# EasyEDA Pro project projet666.eprj, schematic Schematic1

## Sheets
1 Pont + connecteurs: Board Name: Board1; Create Date: 2025-08-06; Page Name: Pont + connecteurs; Project Name: projet666; Schematic Name: Schematic1; Update Date: 2026-02-17; Company: EasyEDA.com; Page Size: A4; Version: V1.0
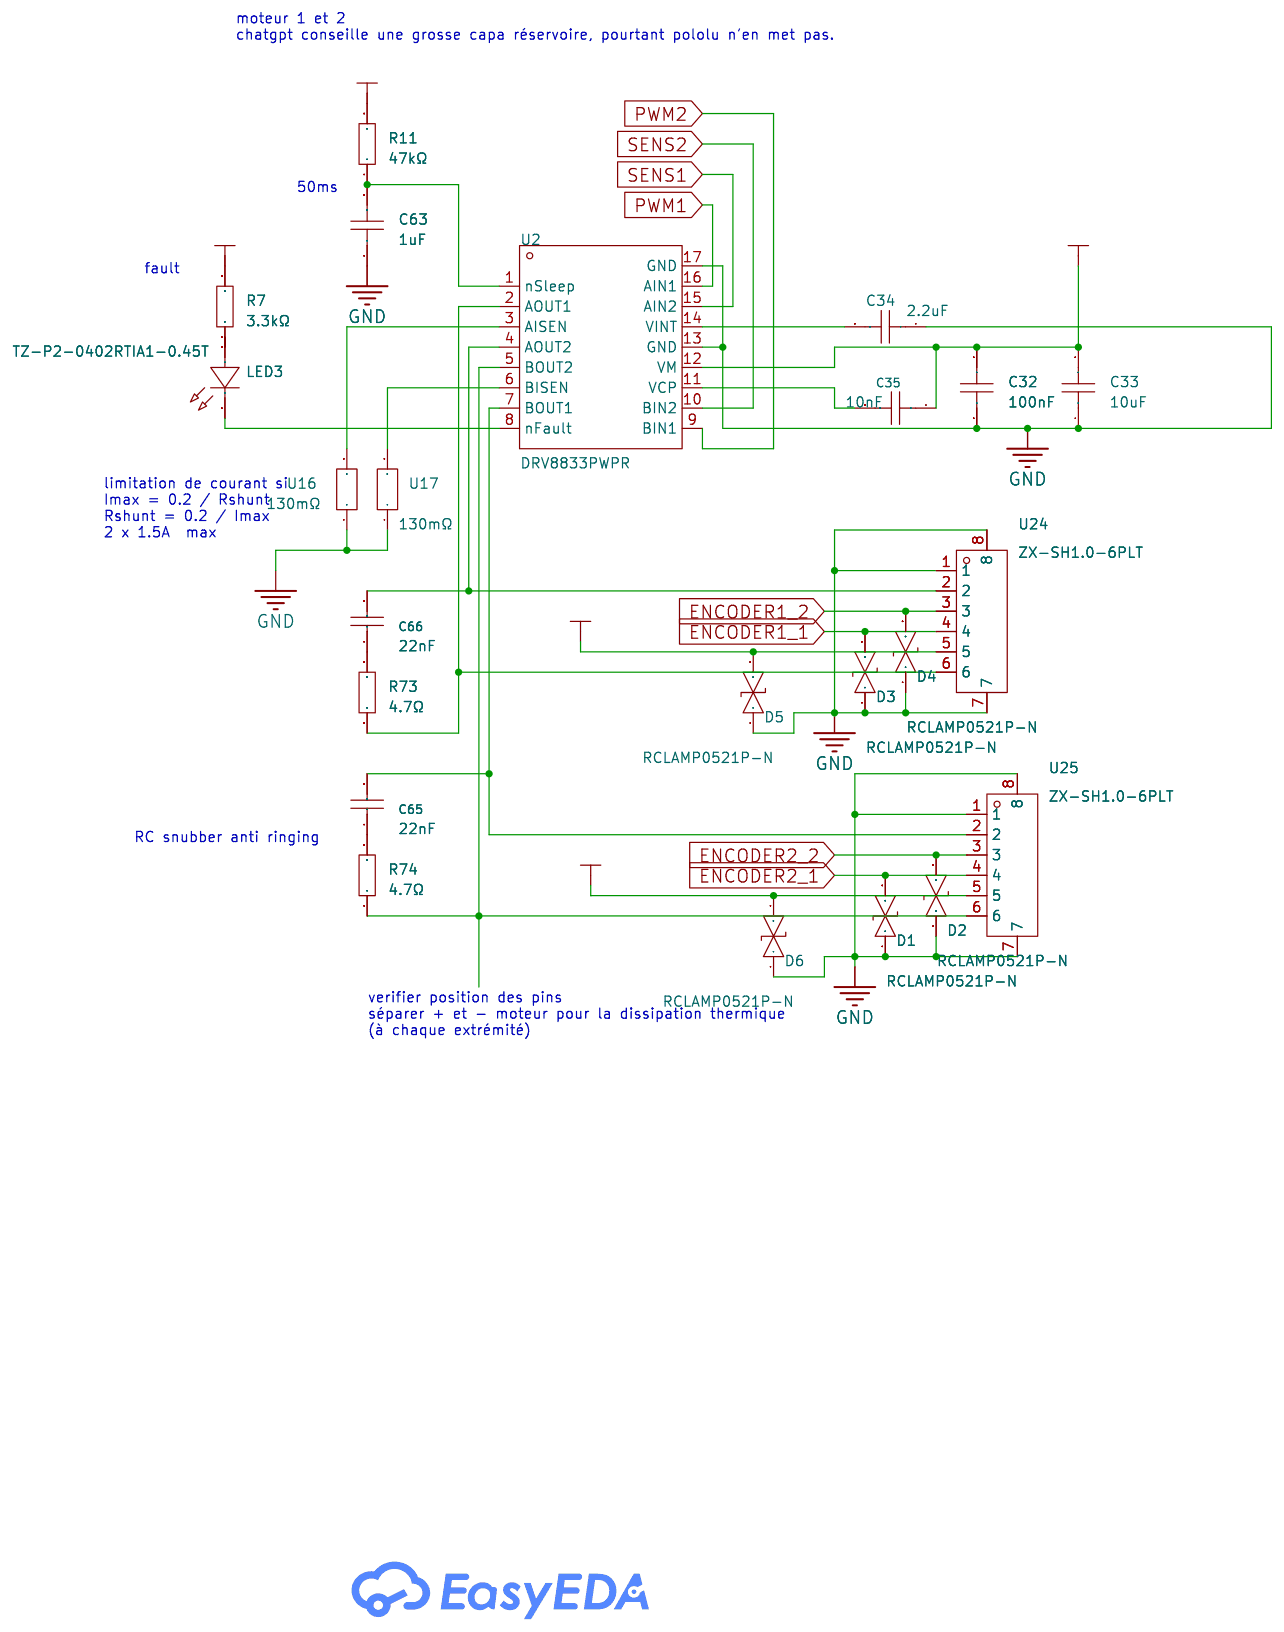
[diagram p0: Pont + connecteurs]
2 stm32: Page Name: stm32; Update Date: 2026-01-31
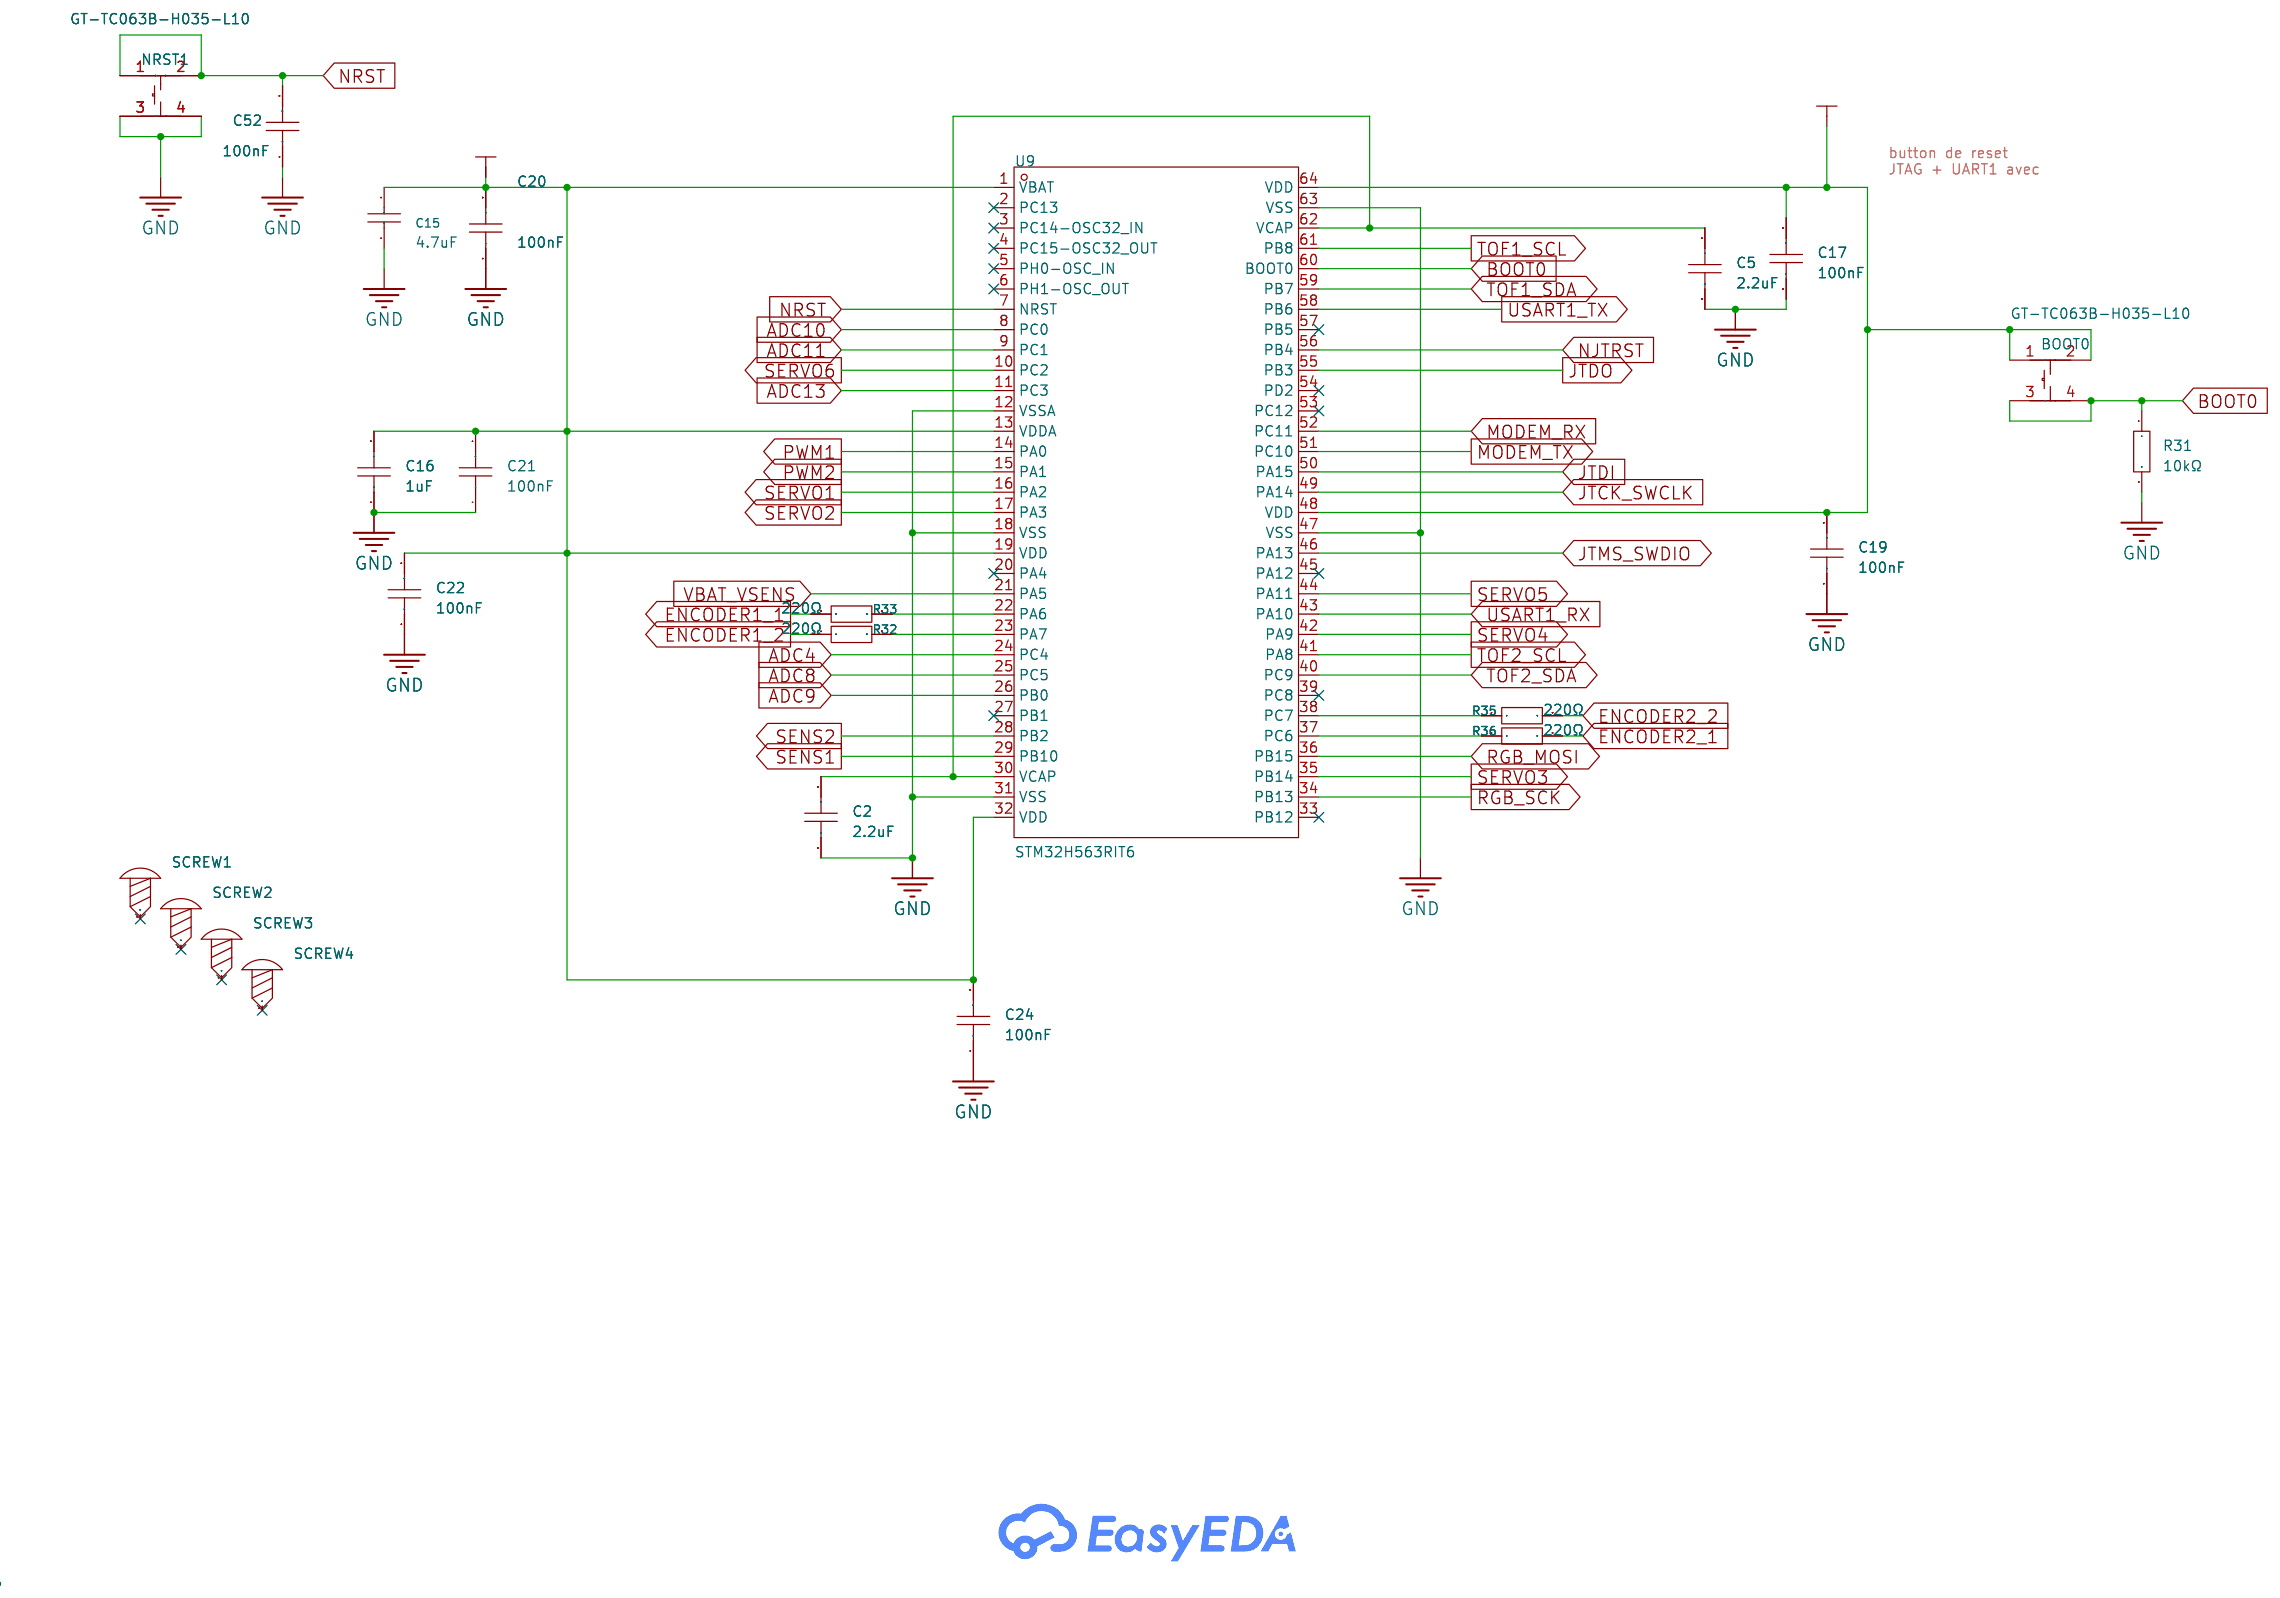
[diagram p1: stm32]
3 alim: Page Name: alim
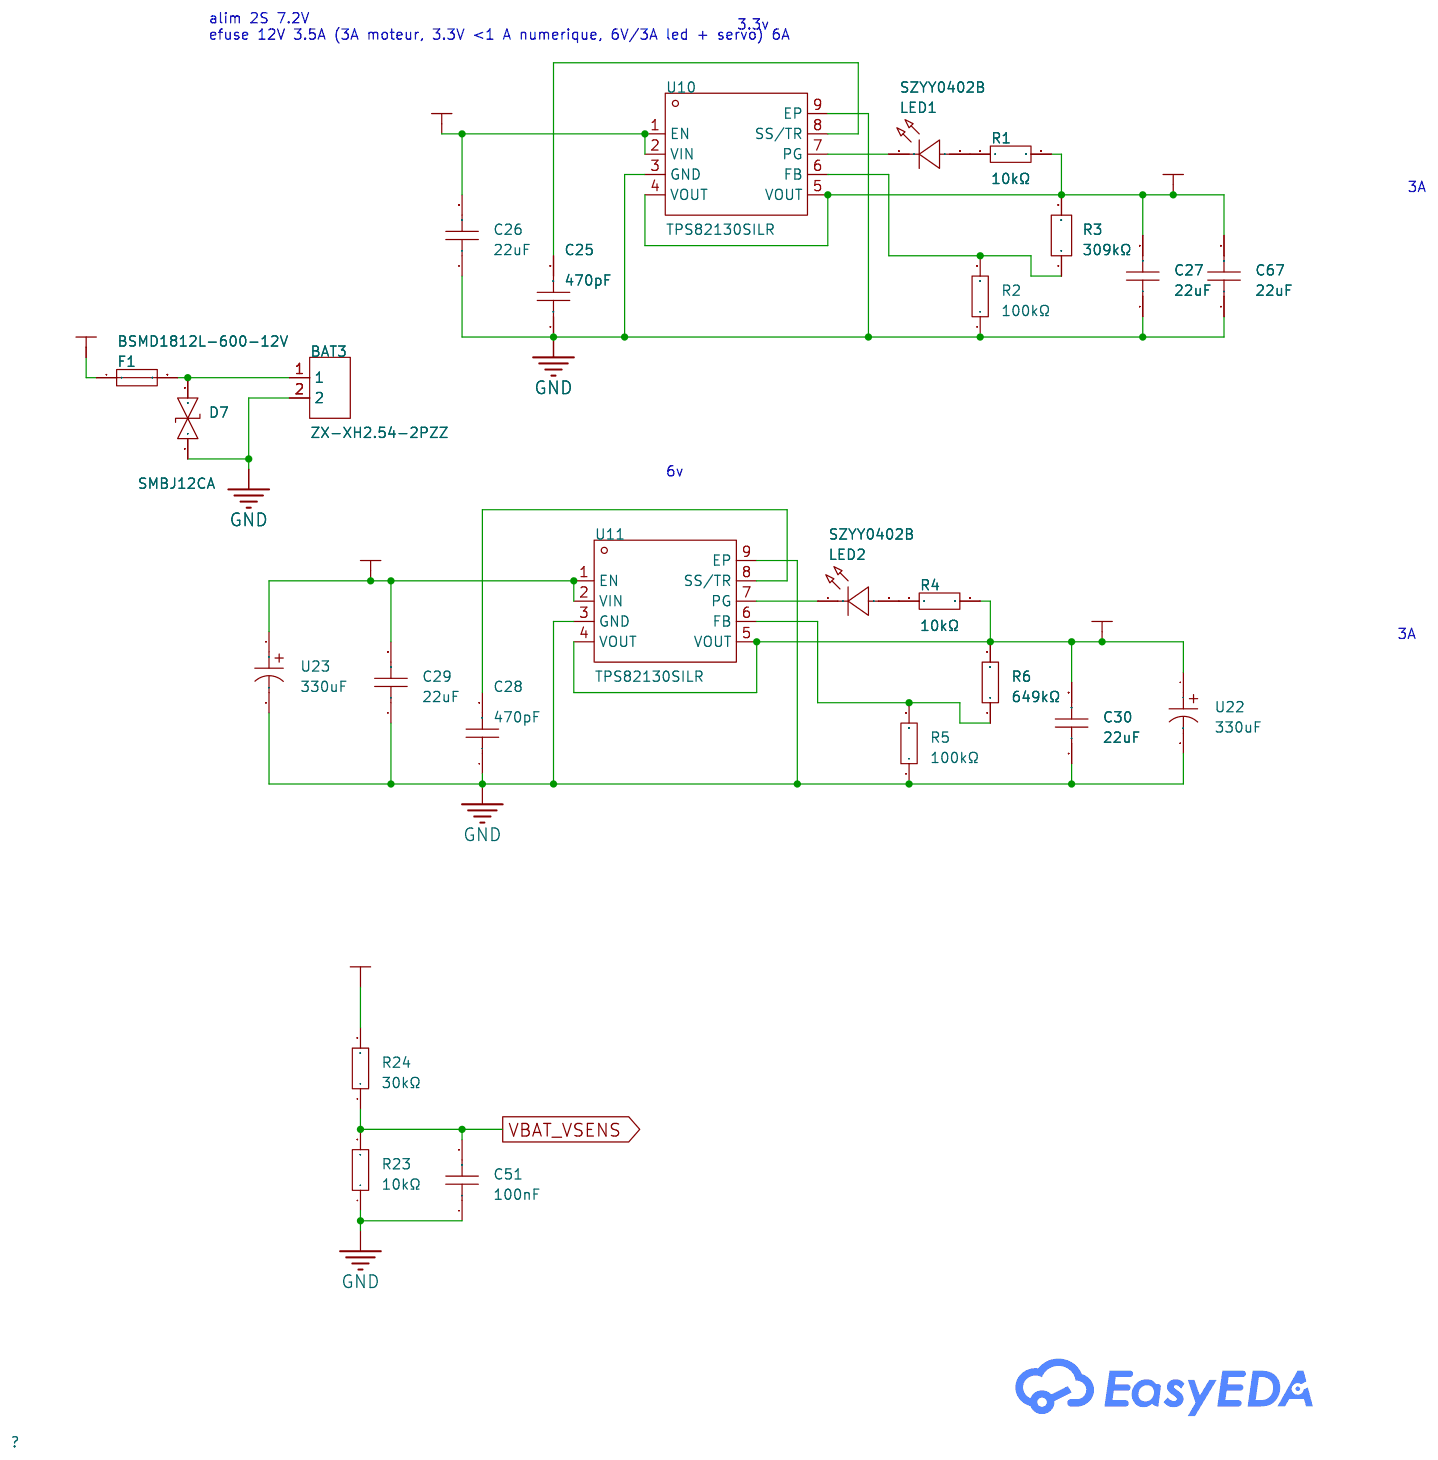
[diagram p2: alim]
4 tof: Page Name: tof; Update Date: 2025-09-26
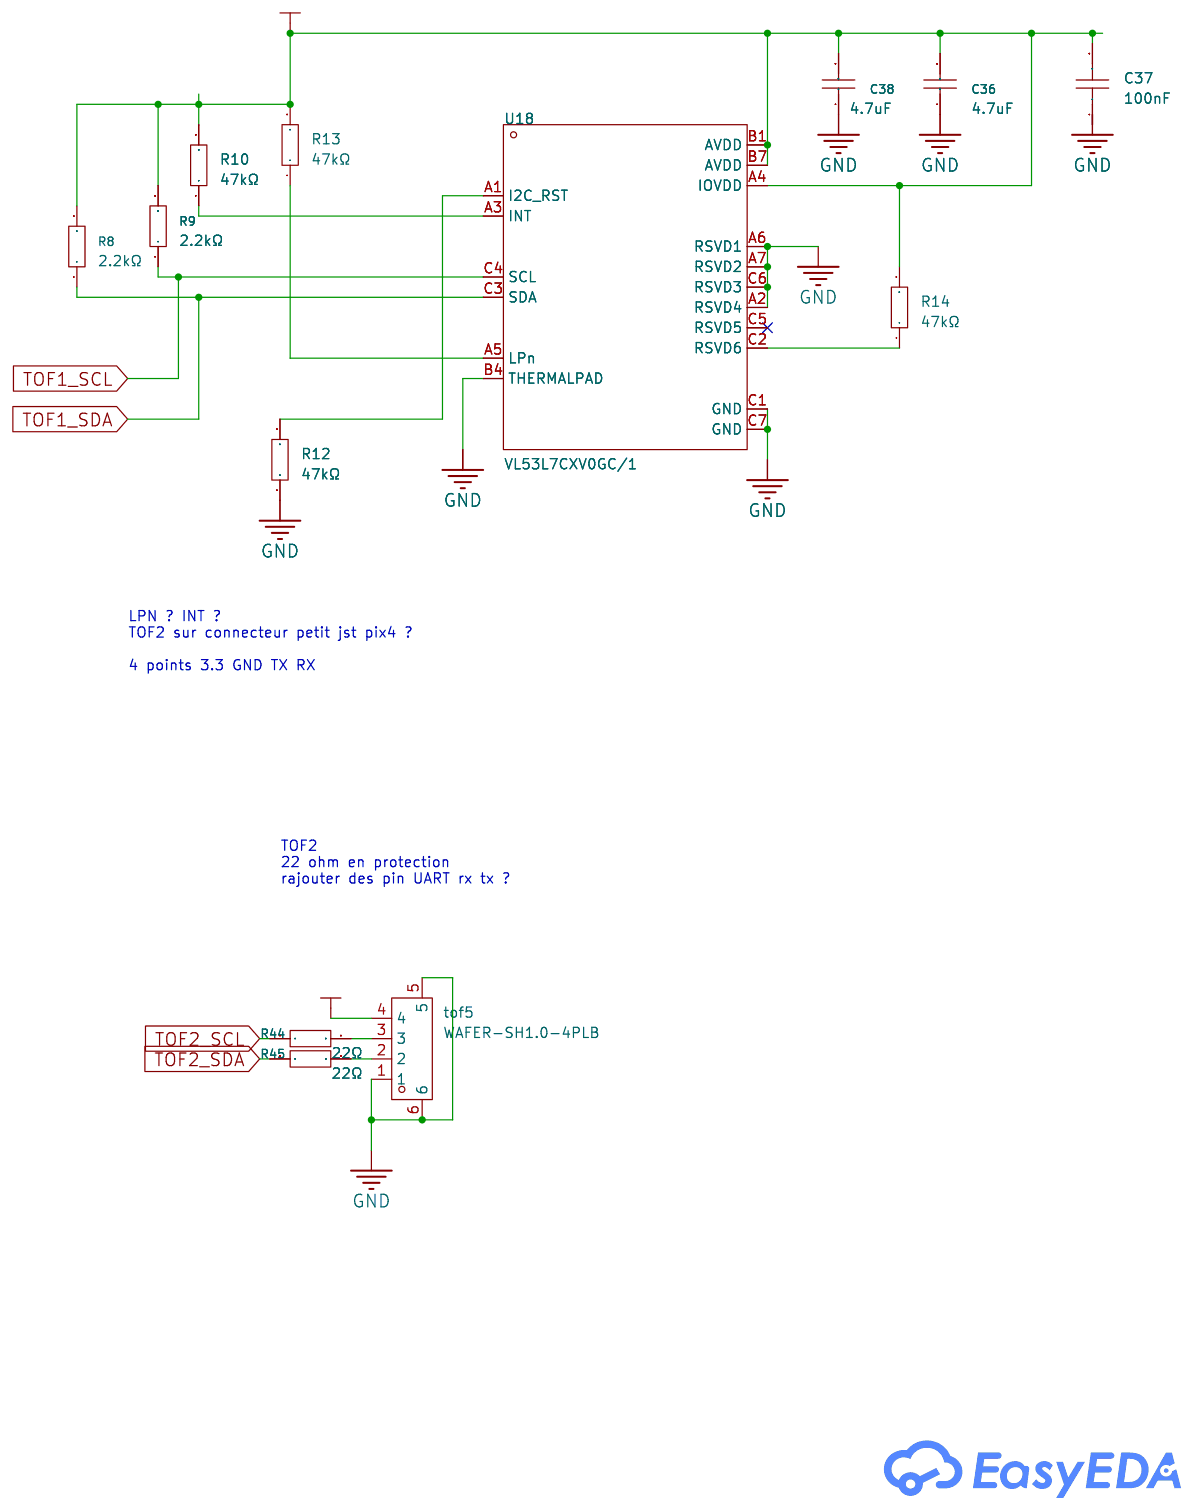
[diagram p3: tof]
5 leds: Create Date: 2025-08-11; Page Name: leds; Update Date: 2026-02-08
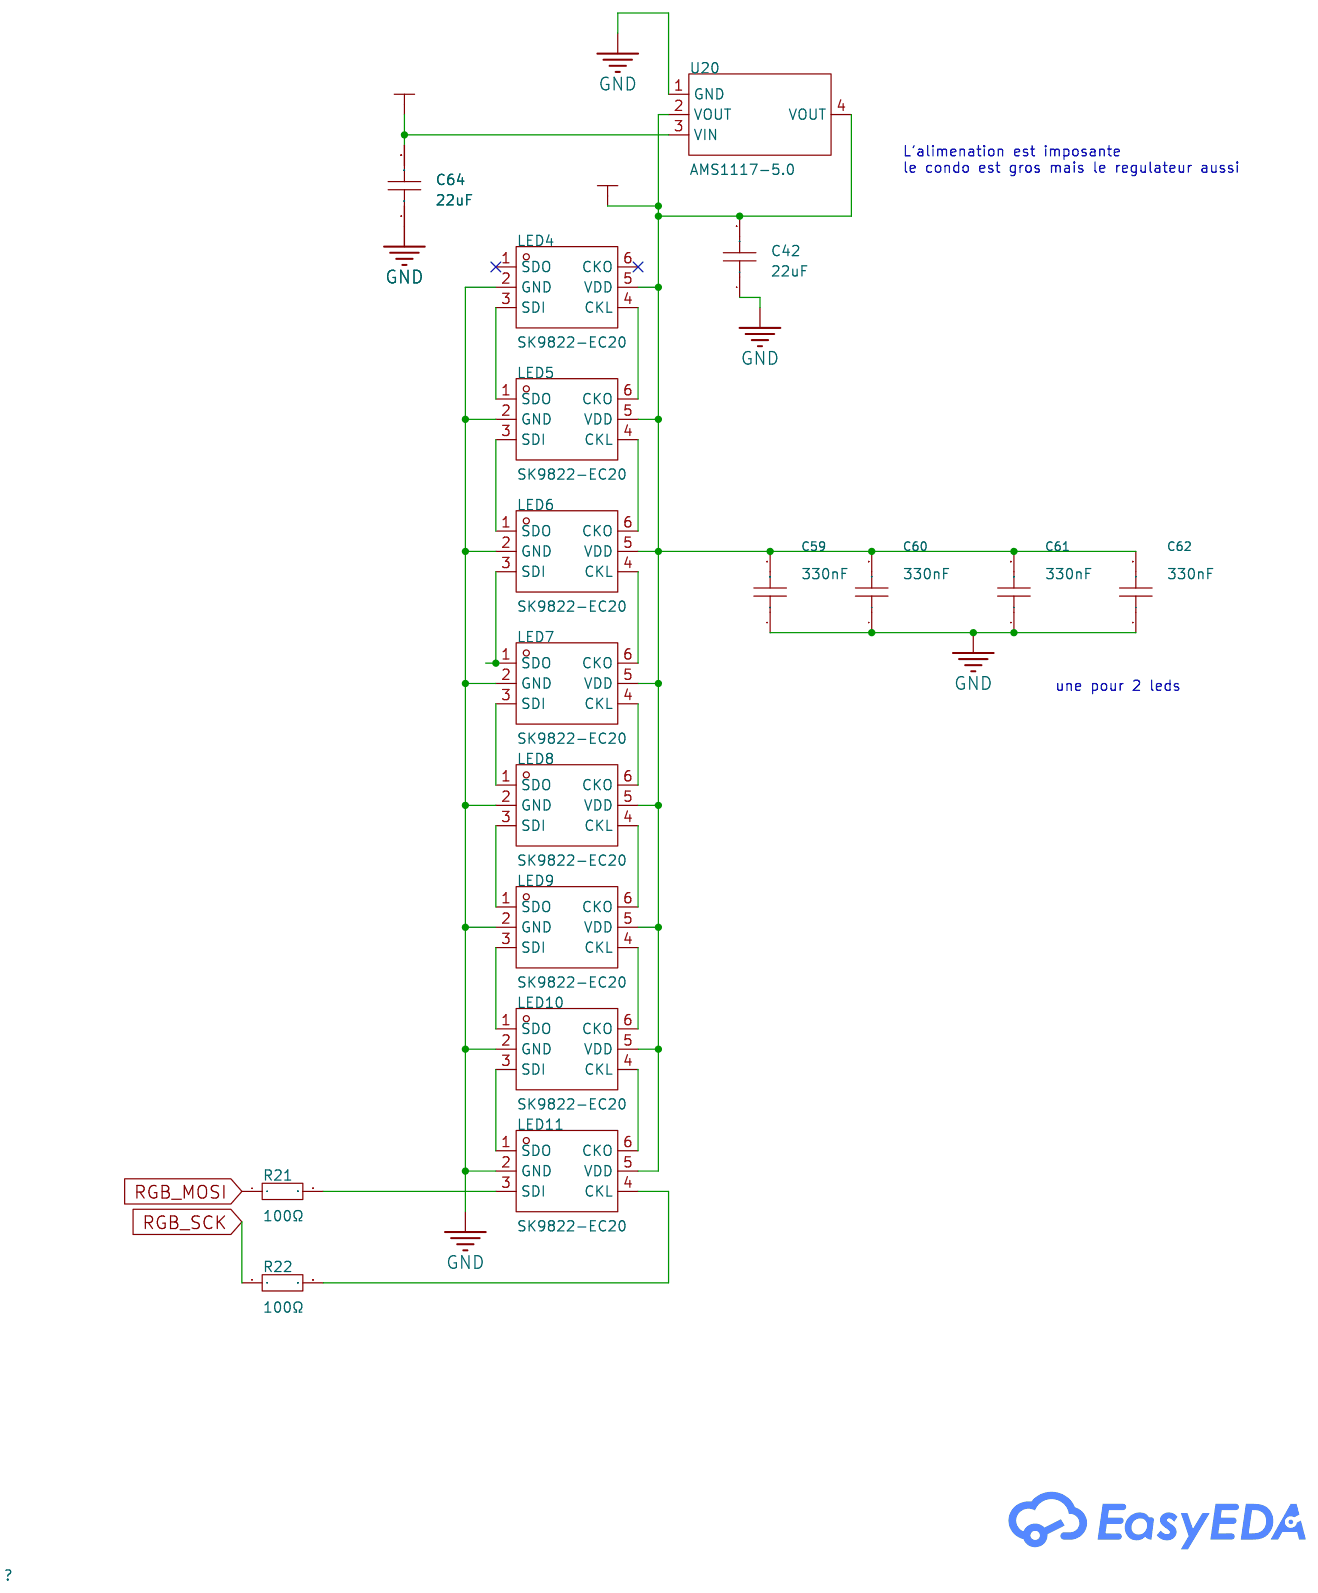
[diagram p4: leds]
6 servo: Create Date: 2025-08-26; Page Name: servo
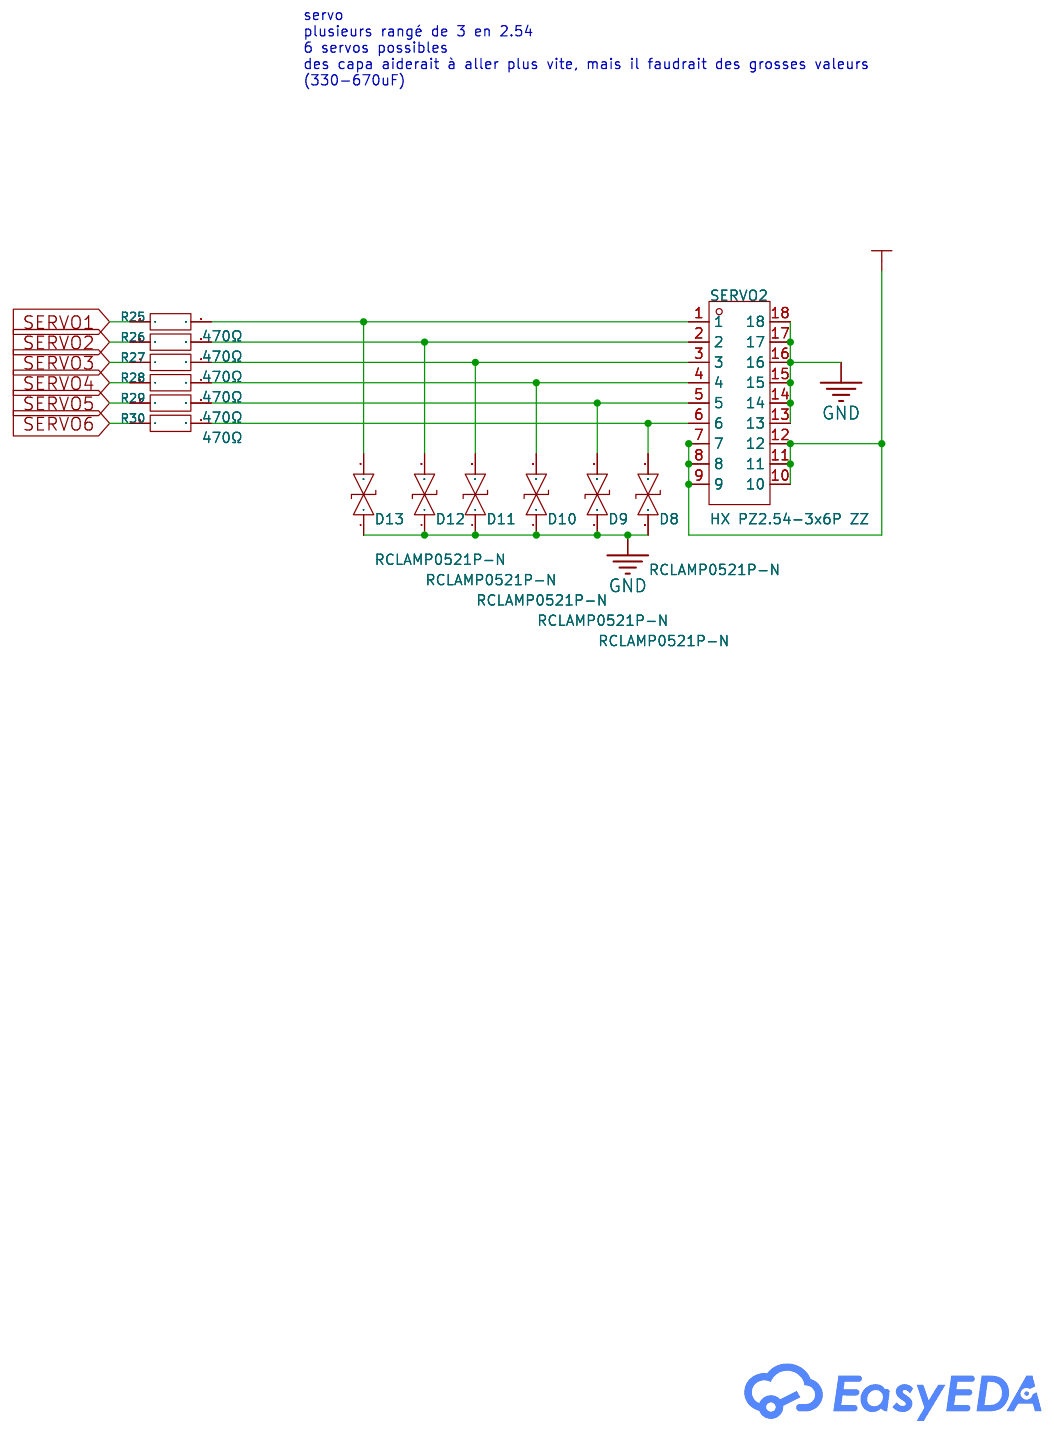
[diagram p5: servo]
7 esp32: Create Date: 2025-08-30; Page Name: esp32; Update Date: 2026-02-01
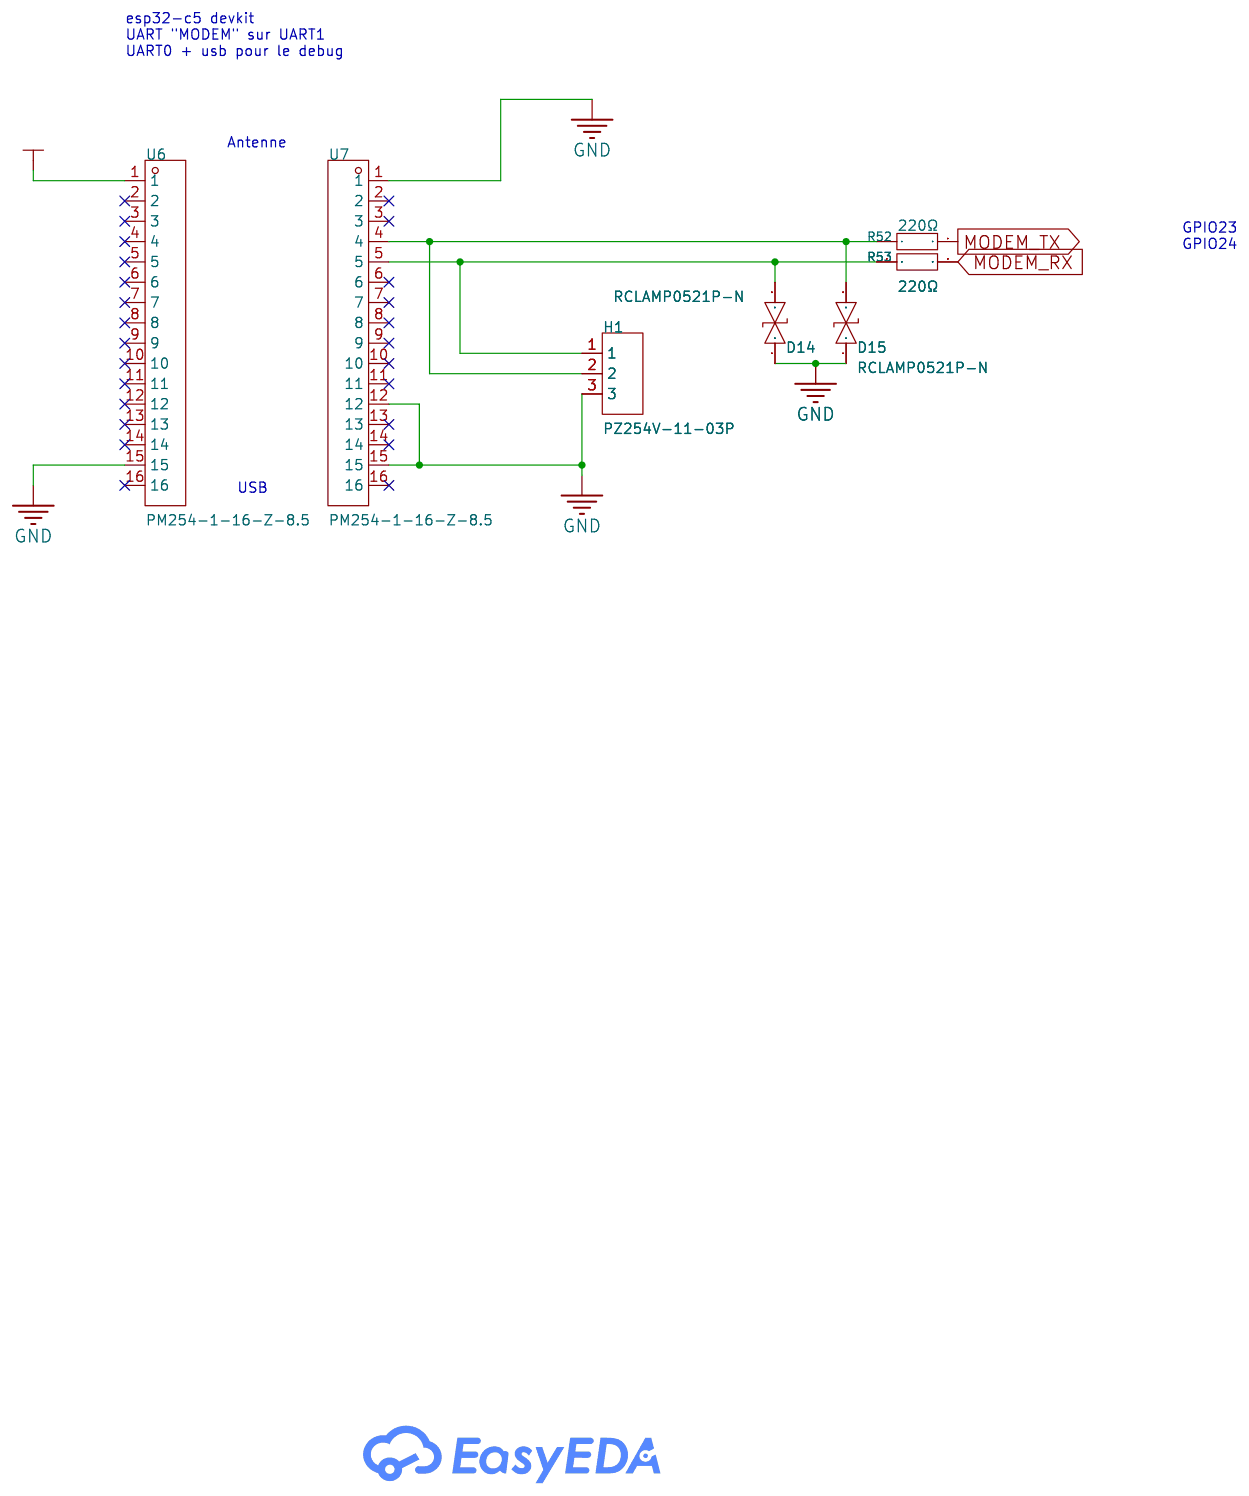
[diagram p6: esp32]
8 jtag: Create Date: 2025-08-30; Page Name: jtag
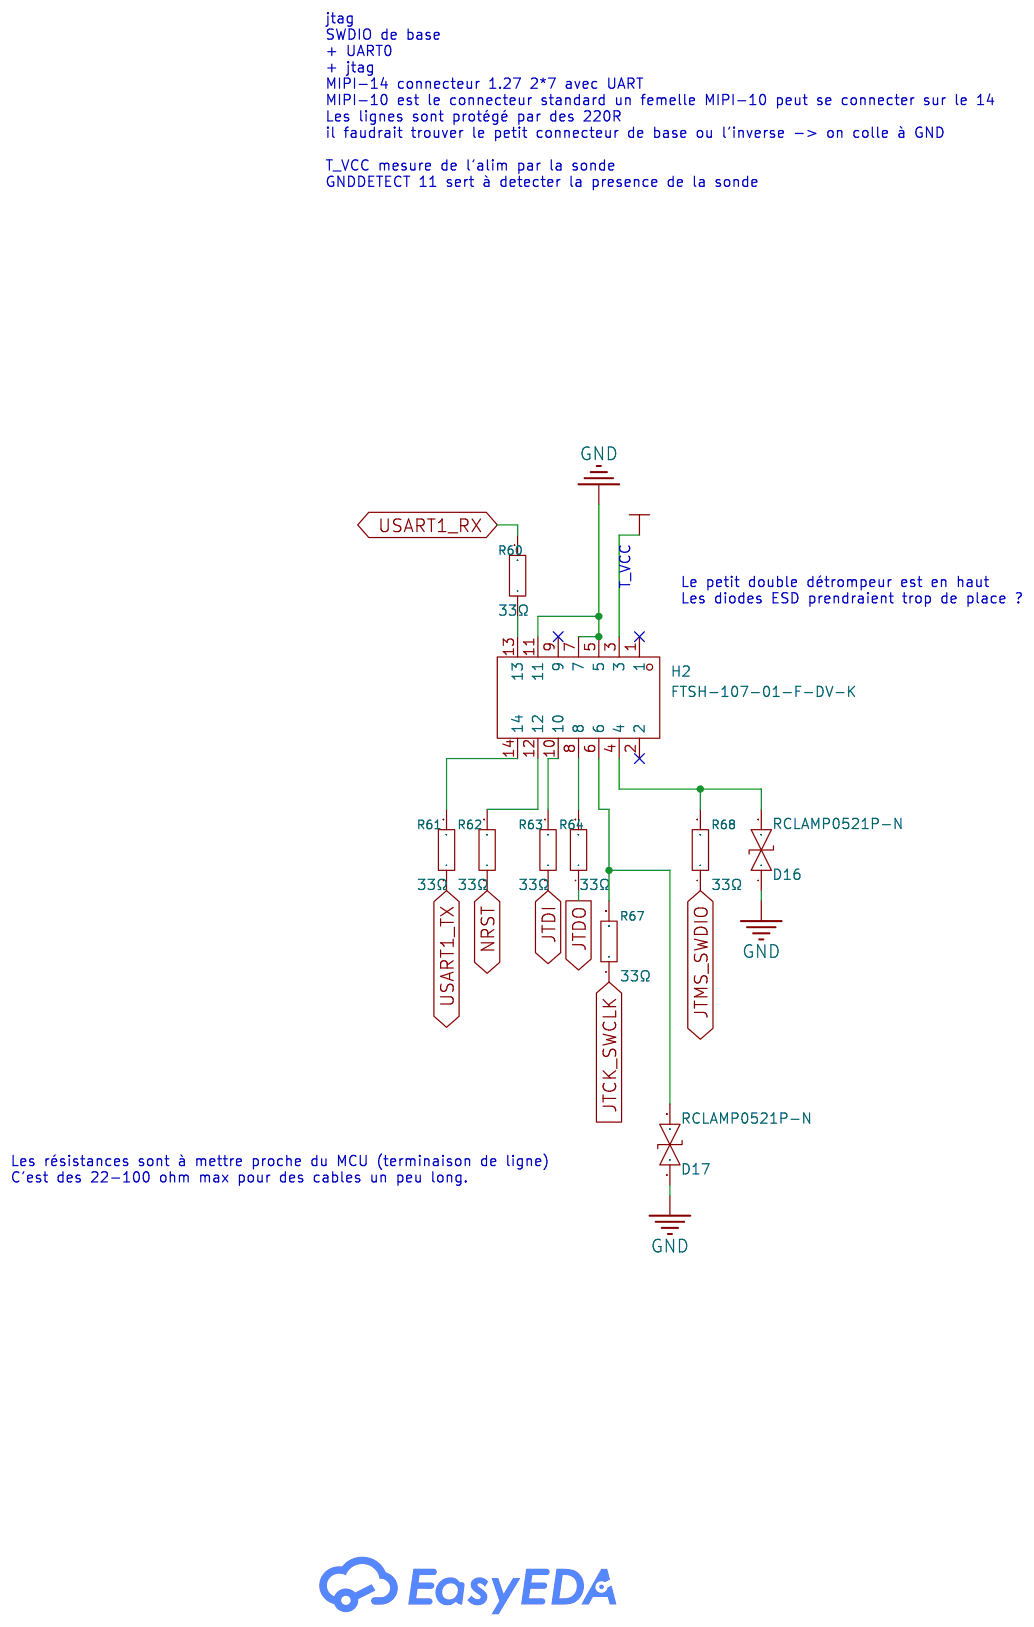
[diagram p7: jtag]
9 ADC: Create Date: 2025-09-14; Page Name: ADC; Update Date: 2025-09-28
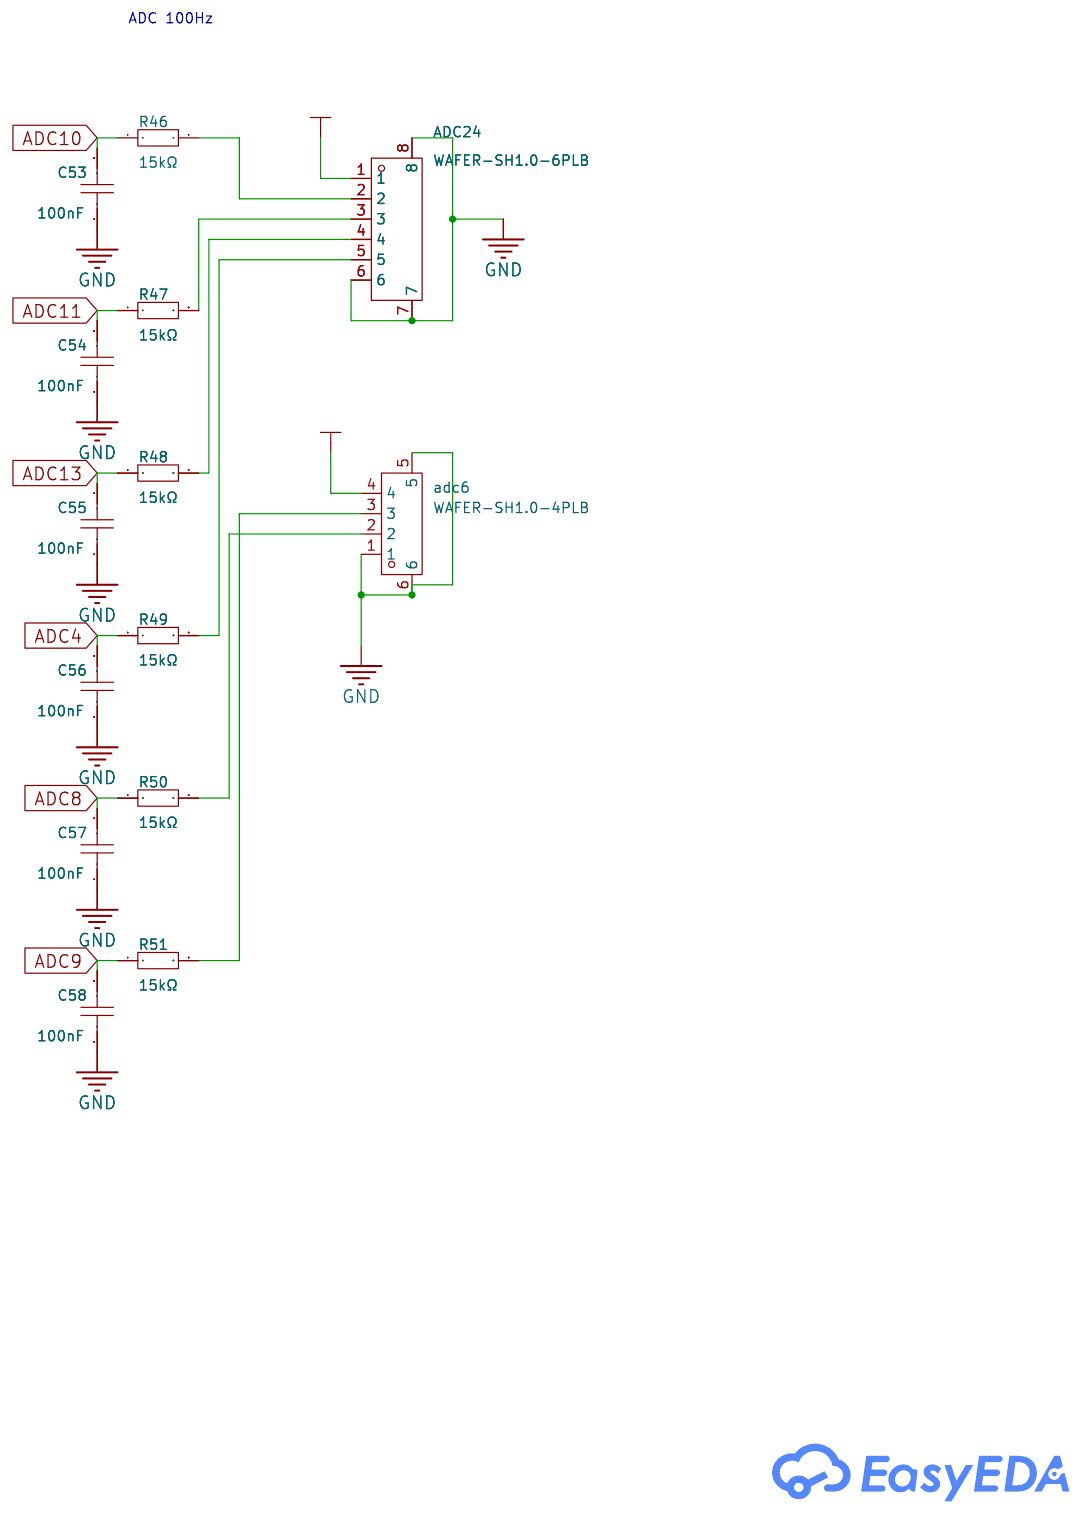
[diagram p8: ADC]

## Parts
sheet ADC
adc6  WAFER-SH1.0-4PLB  [CONN-SMD_4P-P1.00-C3029334]
ADC24  WAFER-SH1.0-6PLB  [CONN-SMD_6P-P1.00_1734595-6]
C53  100nF  [C0201]
C54  100nF  [C0201]
C55  100nF  [C0201]
C56  100nF  [C0201]
C57  100nF  [C0201]
C58  100nF  [C0201]
R46  15kΩ  [R0402]
R47  15kΩ  [R0402]
R48  15kΩ  [R0402]
R49  15kΩ  [R0402]
R50  15kΩ  [R0402]
R51  15kΩ  [R0402]
sheet alim
BAT3  ZX-XH2.54-2PZZ  [CONN-TH_2P-P2.50_HX25003-2A]
C25  470pF  [C0201]
C26  22uF  [C0805]
C27  22uF  [C0805]
C28  470pF  [C0201]
C29  22uF  [C0805]
C30  22uF  [C0805]
C51  100nF  [C0201]
C67  22uF  [C0805]
D7  SMBJ12CA  [SMB_L4.4-W3.6-LS5.3-BI]
F1  BSMD1812L-600-12V  [F1812]
LED1  SZYY0402B  [LED0402-RD_BLUE]
LED2  SZYY0402B  [LED0402-RD_BLUE]
R1  10kΩ  [R0402]
R2  100kΩ  [R0402]
R3  309kΩ  [R0402]
R4  10kΩ  [R0402]
R5  100kΩ  [R0402]
R6  649kΩ  [R0402]
R23  10kΩ  [R0402]
R24  30kΩ  [R0402]
U10  TPS82130SILR  [USIP-8_L3.0-W2.8-P0.65-TL-EP]
U11  TPS82130SILR  [USIP-8_L3.0-W2.8-P0.65-TL-EP]
U22  330uF  [CAP-SMD_BD6.3-L6.6-W6.6-LS7.4-FD]
U23  330uF  [CAP-SMD_BD6.3-L6.6-W6.6-LS7.4-FD]
sheet esp32
D14  RCLAMP0521P-N  [X1-DFN1006-2_L1.0-W0.6-P0.65-BI]
D15  RCLAMP0521P-N  [X1-DFN1006-2_L1.0-W0.6-P0.65-BI]
H1  PZ254V-11-03P  [HDR-TH_3P-P2.54-V-M]
R52  220Ω  [R0603]
R53  220Ω  [R0603]
U6  PM254-1-16-Z-8.5  [HDR-TH_16P-P2.54-V-F-A]
U7  PM254-1-16-Z-8.5  [HDR-TH_16P-P2.54-V-F-A]
sheet jtag
D16  RCLAMP0521P-N  [X1-DFN1006-2_L1.0-W0.6-P0.65-BI]
D17  RCLAMP0521P-N  [X1-DFN1006-2_L1.0-W0.6-P0.65-BI]
H2  FTSH-107-01-F-DV-K  [CONN-SMD_14P-P1.27_FTSH-107-01-F-DV-K-P-TR]
R60  33Ω  [R0402]
R61  33Ω  [R0402]
R62  33Ω  [R0402]
R63  33Ω  [R0402]
R64  33Ω  [R0402]
R67  33Ω  [R0402]
R68  33Ω  [R0402]
sheet leds
C42  22uF  [C0805]
C59  330nF  [C1206]
C60  330nF  [C1206]
C61  330nF  [C1206]
C62  330nF  [C1206]
C64  22uF  [C0805]
LED4  SK9822-EC20  [LED-SMD_6P-L2.0-W2.0-P0.80-TL]
LED5  SK9822-EC20  [LED-SMD_6P-L2.0-W2.0-P0.80-TL]
LED6  SK9822-EC20  [LED-SMD_6P-L2.0-W2.0-P0.80-TL]
LED7  SK9822-EC20  [LED-SMD_6P-L2.0-W2.0-P0.80-TL]
LED8  SK9822-EC20  [LED-SMD_6P-L2.0-W2.0-P0.80-TL]
LED9  SK9822-EC20  [LED-SMD_6P-L2.0-W2.0-P0.80-TL]
LED10  SK9822-EC20  [LED-SMD_6P-L2.0-W2.0-P0.80-TL]
LED11  SK9822-EC20  [LED-SMD_6P-L2.0-W2.0-P0.80-TL]
R21  100Ω  [R0402]
R22  100Ω  [R0402]
U20  AMS1117-5.0  [SOT-223_L6.5-W3.5-P2.30-LS7.0-BR]
sheet Pont + connecteurs
C32  100nF  [C0201]
C33  10uF  [C0805]
C34  2.2uF  [C0402]
C35  10nF  [C0201]
C63  1uF  [C0402]
C65  22nF  [C0603]
C66  22nF  [C0603]
D1  RCLAMP0521P-N  [X1-DFN1006-2_L1.0-W0.6-P0.65-BI]
D2  RCLAMP0521P-N  [X1-DFN1006-2_L1.0-W0.6-P0.65-BI]
D3  RCLAMP0521P-N  [X1-DFN1006-2_L1.0-W0.6-P0.65-BI]
D4  RCLAMP0521P-N  [X1-DFN1006-2_L1.0-W0.6-P0.65-BI]
D5  RCLAMP0521P-N  [X1-DFN1006-2_L1.0-W0.6-P0.65-BI]
D6  RCLAMP0521P-N  [X1-DFN1006-2_L1.0-W0.6-P0.65-BI]
LED3  TZ-P2-0402RTIA1-0.45T  [LED0402-RD_RED]
R7  3.3kΩ  [R0402]
R11  47kΩ  [R0402]
R73  4.7Ω  [R0603]
R74  4.7Ω  [R0603]
U2  DRV8833PWPR  [TSSOP-16_L5.0-W4.4-P0.65-LS6.4-BL-EP]
U16  130mΩ  [R1206]
U17  130mΩ  [R1206]
U24  ZX-SH1.0-6PLT  [CONN-SMD_6P-P1.00_ZX-SH1.0-6PLT]
U25  ZX-SH1.0-6PLT  [CONN-SMD_6P-P1.00_ZX-SH1.0-6PLT]
sheet servo
D8  RCLAMP0521P-N  [X1-DFN1006-2_L1.0-W0.6-P0.65-BI]
D9  RCLAMP0521P-N  [X1-DFN1006-2_L1.0-W0.6-P0.65-BI]
D10  RCLAMP0521P-N  [X1-DFN1006-2_L1.0-W0.6-P0.65-BI]
D11  RCLAMP0521P-N  [X1-DFN1006-2_L1.0-W0.6-P0.65-BI]
D12  RCLAMP0521P-N  [X1-DFN1006-2_L1.0-W0.6-P0.65-BI]
D13  RCLAMP0521P-N  [X1-DFN1006-2_L1.0-W0.6-P0.65-BI]
R25  470Ω  [R0402]
R26  470Ω  [R0402]
R27  470Ω  [R0402]
R28  470Ω  [R0402]
R29  470Ω  [R0402]
R30  470Ω  [R0402]
SERVO2  HX PZ2.54-3x6P ZZ  [CONN-TH_HX-PZ2.54-3X6P-ZZ]
sheet stm32
BOOT0  GT-TC063B-H035-L10  [SW-SMD_4P-L6.2-W6.2-P4.00-LS7.0]
C2  2.2uF  [C0402]
C5  2.2uF  [C0402]
C15  4.7uF  [C0402]
C16  1uF  [C0402]
C17  100nF  [C0201]
C19  100nF  [C0201]
C20  100nF  [C0201]
C21  100nF  [C0201]
C22  100nF  [C0201]
C24  100nF  [C0201]
C52  100nF  [C0201]
NRST1  GT-TC063B-H035-L10  [SW-SMD_4P-L6.2-W6.2-P4.00-LS7.0]
R31  10kΩ  [R0402]
R32  220Ω  [R0603]
R33  220Ω  [R0603]
R35  220Ω  [R0603]
R36  220Ω  [R0603]
SCREW1  -  [Screw-Hole-M2]
SCREW2  -  [Screw-Hole-M2]
SCREW3  -  [Screw-Hole-M2]
SCREW4  -  [Screw-Hole-M2]
U9  STM32H563RIT6  [LQFP-64_L10.0-W10.0-P0.50-LS12.0-BL]
sheet tof
C36  4.7uF  [C0402]
C37  100nF  [C0201]
C38  4.7uF  [C0402]
R8  2.2kΩ  [R0402]
R9  2.2kΩ  [R0402]
R10  47kΩ  [R0402]
R12  47kΩ  [R0402]
R13  47kΩ  [R0402]
R14  47kΩ  [R0402]
R44  22Ω  [R0402]
R45  22Ω  [R0402]
tof5  WAFER-SH1.0-4PLB  [CONN-SMD_4P-P1.00-C3029334]
U18  VL53L7CXV0GC/1  [LGA-16_L6.4-W3.0_VL53L5CXV0GC-1]

## Library data of the parts
adc6 tof5 = WAFER-SH1.0-4PLB: Pins Structure:1x4P Pitch:1mm Mounting Type:Standing paste Reference Series:SH Number of Pins:4P Number of Rows:1 Number of PINs Per Row:4 Row Spacing:- Current Rating:1A Contact Material:Brass Contact Plating:- Operating Temperature:-25℃~+85℃ Operating T; LCSC Part Name: 1x4P 间距:1mm 立贴 系列:SH; Supplier Part: C3029334; Manufacturer: XUNPU(讯普); Supplier Footprint: SMD,P=1mm; JLCPCB Part Class: Extended Part; Datasheet: https://atta.szlcsc.com/upload/public/pdf/source/20220527/2BC543D78697EB0EE4D2C73A161B184B.pdf; Supplier: LCSC; Pins Structure: 1x4P; Pitch: 1mm; Mounting Type: Standing paste; Reference Series: SH; Number of Pins: 4P; Number of Rows: 1; Number of PINs Per Row: 4; Current Rating: 1A; Contact Material: Brass; Operating Temperature: -25℃~+85℃; Voltage Rating: 50V; Plastic Material: LCP; Supplementary Features: Auxiliary soldering legs; Color: Beige; Z-Height of the Board: 4.4mm; X-Length of Bottom Edge on Board (Spacing Line): 6.35mm; Y-Width of Bottom Edge on Board: 3.74mm
ADC24 = WAFER-SH1.0-6PLB: Pins Structure:1x6P Pitch:1mm Mounting Type:Standing paste Reference Series:SH Number of Pins:6P Number of Rows:1 Number of PINs Per Row:6 Row Spacing:- Current Rating:1A Contact Material:Brass Contact Plating:- Operating Temperature:-25℃~+85℃ Operating T; LCSC Part Name: 1x6P 间距:1mm 立贴 系列:SH; Supplier Part: C3029336; Manufacturer: XUNPU(讯普); Supplier Footprint: SMD,P=1mm; JLCPCB Part Class: Extended Part; Datasheet: https://atta.szlcsc.com/upload/public/pdf/source/20220527/2BC543D78697EB0EE4D2C73A161B184B.pdf; Supplier: LCSC; Pins Structure: 1x6P; Pitch: 1mm; Mounting Type: Standing paste; Reference Series: SH; Number of Pins: 6P; Number of Rows: 1; Number of PINs Per Row: 6; Current Rating: 1A; Contact Material: Brass; Operating Temperature: -25℃~+85℃; Voltage Rating: 50V; Plastic Material: LCP; Supplementary Features: Auxiliary soldering legs; Color: Beige; Z-Height of the Board: 4.4mm; X-Length of Bottom Edge on Board (Spacing Line): 8.35mm; Y-Width of Bottom Edge on Board: 3.74mm
C17 C19-C22 C24 C32 C37 C51-C58 = 0201X104K160NT: Capacitance:100nF Tolerance:±10% Tolerance:±10% Voltage Rating:16V Temperature Coefficient:X5R; LCSC Part Name: 100nF ±10% 16V; Supplier Part: C2846674; Manufacturer: FH(风华); Supplier Footprint: 0201; JLCPCB Part Class: Extended Part; Datasheet: https://atta.szlcsc.com/upload/public/pdf/source/20220211/3FDF6092789FC56E23A16E03DC7301F9.pdf; Supplier: LCSC; Tolerance: ±10%; Voltage Rating: 16V; Temperature Coefficient: X5R
R46-R51 = RC0402FR-0715KL: LCSC Part Name: 厚膜电阻 15kΩ ±1% 62.5mW; Supplier Part: C114761; Manufacturer: YAGEO(国巨); Supplier Footprint: 0402; JLCPCB Part Class: Extended Part; Datasheet: https://atta.szlcsc.com/upload/public/pdf/source/20180821/C275644_0D56F95EFF785E7D9A1FEF436B37DA78.pdf; Supplier: LCSC; Type: Thick Film Resistors; Tolerance: ±1%; Temperature Coefficient: ±100ppm/℃; Operating Temperature Range: -55℃~+155℃
BAT3 = ZX-XH2.54-2PZZ: Pins Structure:1x2P Pitch:2.5mm Mounting Type:Through Hole Reference Series:XH Number of Pins:2P Number of Rows:1 Number of PINs Per Row:2 Row Spacing:- Current Rating:3A Contact Material:Brass Contact Plating:Tin Operating Temperature:-25℃~+85℃ Operating; LCSC Part Name: 1x2P 间距:2.5mm 直插 系列:XH; Supplier Part: C7429632; Manufacturer: Megastar(兆星); Supplier Footprint: 插件,P=2.5mm; JLCPCB Part Class: Extended Part; Datasheet: https://atta.szlcsc.com/upload/public/pdf/source/20230619/19BA6947230AA44A04D3EDD65E618FD0.pdf; Supplier: LCSC; Pins Structure: 1x2P; Pitch: 2.5mm; Mounting Type: Through Hole; Reference Series: XH; Number of Pins: 2P; Number of Rows: 1; Number of PINs Per Row: 2; Current Rating: 3A; Contact Material: Brass; Contact Plating: Tin; Operating Temperature: -25℃~+85℃; Voltage Rating: 250V; Plastic Material: PA66; Flame Retardant Rating: UL94V-0; Color: White; Z-Height of the Board: 7mm; X-Length of Bottom Edge on Board (Spacing Line): 7.5mm; Y-Width of Bottom Edge on Board: 5.9mm
C25 C28 = GRM0335C1E471JA01D: Capacitance:470pF Tolerance:±5% Tolerance:±5% Voltage Rating:25V Temperature Coefficient:C0G; LCSC Part Name: 470pF ±5% 25V; Supplier Part: C161390; Manufacturer: muRata(村田); Supplier Footprint: 0201; JLCPCB Part Class: Extended Part; Datasheet: https://atta.szlcsc.com/upload/public/pdf/source/20200305/C490387_23319AE8C154DEB24C505E6C82A8106A.pdf; Supplier: LCSC; Tolerance: ±5%; Voltage Rating: 25V; Temperature Coefficient: C0G
C26 C27 C29 C30 C42 C64 C67 = CL21A226MAYNNNE: Capacitance: Tolerance:±20% Tolerance:±20% Voltage Rated: Temperature Coefficient:; LCSC Part Name: 22uF ±20% 25V; Supplier Part: C602037; Manufacturer: SAMSUNG(三星); Supplier Footprint: 0805; JLCPCB Part Class: Extended Part; Datasheet: https://atta.szlcsc.com/upload/public/pdf/source/20200609/C602037_1A0D619693E608A1BF6E80154254E2DB.pdf; Supplier: LCSC; Tolerance: ±20%
D7 = SMBJ12CA_C353397: LCSC Part Name: TVS 12V截止 峰值浪涌电流：30.2A@10/1000us; Supplier Part: C353397; Manufacturer: 晶导微电子; Supplier Footprint: SMB; JLCPCB Part Class: Extended Part; Datasheet: https://item.szlcsc.com/datasheet/SMBJ12CA/329146.html; Supplier: LCSC; Reverse Stand-Off Voltage (Vrwm): 12V; Clamping Voltage: 19.9V; Peak Pulse Current (Ipp): 30.2A@10/1000us; Peak Pulse Power Dissipation (Ppp): 600W@10/1000us; Voltage - Breakdown: 14.7V; Reverse Leakage Current (Ir): 1uA; Operating Temperature: -65℃~+150℃; Type: TVS; Junction Capacitance: 390pF
F1 = BSMD1812L-600-12V: LCSC Part Name: 12V 6A 1812自恢复; Supplier Part: C2844466; Manufacturer: BHFUSE(佰宏); Supplier Footprint: 1812; JLCPCB Part Class: Extended Part; Datasheet: https://item.szlcsc.com/datasheet/BSMD1812L-600-12V/3035358.html; Supplier: LCSC; Voltage - Max: 12V; Current - Max: 50A; Hold Current: 6A; Trip Current: 12A; Power Dissipation: 2W; Resistance - Initial (Ri) (Min): 0.8mΩ; Resistance - Post Trip (R1) (Max): 10mΩ; Time to Trip(Max): 20s; Operating Temperature: -40℃~+85℃
LED1 LED2 = SZYY0402B: Emitted Color:Blue Power Dissipation:- Forward Current:5mA Dominant Wavelength:466nm~469nm Dominant Wavelength:466nm~469nm Peak Wavelength:- Color Temperature:- Color Temperature:- Viewing Angle:120° Mounting Sytle:- Operating Temperature:-40℃~+85℃ Operat; LCSC Part Name: 蓝灯; Supplier Part: C434447; Manufacturer: yongyu(永裕光电); Supplier Footprint: 0402; JLCPCB Part Class: Extended Part; Datasheet: https://atta.szlcsc.com/upload/public/pdf/source/20210222/C434447_30232BB6183B52026028ECA50B9DAB35.pdf; Supplier: LCSC; Emitted Color: Blue; Forward Current: 5mA; Dominant Wavelength: 466nm~469nm; Viewing Angle: 120°; Operating Temperature: -40℃~+85℃
R1 R4 R23 R31 = RC0402FR-0710KL: Type:Thick Film Resistors Resistance: Tolerance:±1% Tolerance:±1% Power(Watts): Overload Voltage (Max): Temperature Coefficient:±100ppm/℃ Temperature Coefficient:±100ppm/℃ Operating Temperature Range:-55℃~+155℃ Operating Temperature Range:-55℃~+155℃; LCSC Part Name: 厚膜电阻 10kΩ ±1% 62.5mW; Supplier Part: C60490; Manufacturer: YAGEO(国巨); Supplier Footprint: 0402; JLCPCB Part Class: Extended Part; Datasheet: https://atta.szlcsc.com/upload/public/pdf/source/20170925/C131467_1506321478108990263.pdf; Supplier: LCSC; Type: Thick Film Resistors; Tolerance: ±1%; Temperature Coefficient: ±100ppm/℃; Operating Temperature Range: -55℃~+155℃
R2 R5 = RC0402FR-07100KL: Type:Thick Film Resistors Resistance: Tolerance:±1% Tolerance:±1% Power(Watts): Overload Voltage (Max): Temperature Coefficient:±100ppm/℃ Temperature Coefficient:±100ppm/℃ Operating Temperature Range:-55℃~+155℃ Operating Temperature Range:-55℃~+155℃; LCSC Part Name: 厚膜电阻 100kΩ ±1% 62.5mW; Supplier Part: C60491; Manufacturer: YAGEO(国巨); Supplier Footprint: 0402; JLCPCB Part Class: Extended Part; Datasheet: https://atta.szlcsc.com/upload/public/pdf/source/20180927/C295883_E8D83085EA81BD7DE0B2B681138C15EE.pdf; Supplier: LCSC; Type: Thick Film Resistors; Tolerance: ±1%; Temperature Coefficient: ±100ppm/℃; Operating Temperature Range: -55℃~+155℃
R3 = FRC0402F3093TS: LCSC Part Name: 309kΩ ±1% 62.5mW 厚膜电阻; Supplier Part: C5713270; Manufacturer: FOJAN(富捷); Supplier Footprint: 0402; JLCPCB Part Class: Extended Part; Supplier: LCSC; Type: Thick Film Resistor; Tolerance: ±1%; Power(Watts): 62.5mW; Voltage-Supply(Max): 50V; Temperature Coefficient: ±100ppm/℃; Operating Temperature: -55℃~+155℃
R6 = RMCF0402FT649K: Type:Thick Film Resistors Resistance: Tolerance:±1% Tolerance:±1% Power(Watts): Overload Voltage (Max): Temperature Coefficient:±100ppm/℃ Temperature Coefficient:±100ppm/℃ Operating Temperature Range:-55℃~+155℃ Operating Temperature Range:-55℃~+155℃; LCSC Part Name: 厚膜电阻 649kΩ ±1% 63mW; Supplier Part: C91064; Manufacturer: SEI(Stackpole Electronics Inc.); Supplier Footprint: 0402; JLCPCB Part Class: Extended Part; Datasheet: https://atta.szlcsc.com/upload/public/pdf/source/20181012/C91064_706BAF5AB8F27F92BA3654BC1ADD1294.pdf; Supplier: LCSC; Type: Thick Film Resistors; Tolerance: ±1%; Temperature Coefficient: ±100ppm/℃; Operating Temperature Range: -55℃~+155℃
R24 = RC0402FR-0730KL: LCSC Part Name: 厚膜电阻 30kΩ ±1% 62.5mW; Supplier Part: C138008; Manufacturer: YAGEO(国巨); Supplier Footprint: 0402; JLCPCB Part Class: Extended Part; Datasheet: https://atta.szlcsc.com/upload/public/pdf/source/20250610/89E4D743C004A82A45145C7A2CC3A578.pdf; Supplier: LCSC; Type: Thick Film Resistor; Tolerance: ±1%; Power(Watts): 62.5mW; Voltage-Supply(Max): 50V; Temperature Coefficient: ±100ppm/℃; Operating Temperature: -55℃~+155℃
U10 U11 = TPS82130SILR: Supplier Part: C473914; Manufacturer: TI(德州仪器); Supplier Footprint: USIP-8; JLCPCB Part Class: Extended Part; Datasheet: https://www.ti.com/cn/lit/gpn/tps82130; Supplier: LCSC
U22 U23 = RVT1A331M0607_C7419412: LCSC Part Name: 330uF ±20% 10V; Supplier Part: C7419412; Manufacturer: ROQANG(容强); Manufacturer Part: RVT1A331M0607; Supplier Footprint: SMD,D6.3xL7.7mm; JLCPCB Part Class: Extended Part; Datasheet: https://atta.szlcsc.com/upload/public/pdf/source/20240430/3EB58B4CA3F3E3C85A0F856558F131F2.pdf; Supplier: LCSC; Tolerance: ±20%; Voltage Rating: 10V; Ripple Current: 108mA@120Hz; Diameter: 6.3mm; Height - Seated (Max): 7.7mm; Lifetime: 2000hrs@105℃; Operating Temperature: -40℃~+105℃
D1-D6 D8-D17 = RCLAMP0521P-N: LCSC Part Name: 双向TVS 5V截止 峰值脉冲电流：3.5A@8/20us; Supplier Part: C316043; Manufacturer: BORN(伯恩半导体); Supplier Footprint: DFN1006-2; JLCPCB Part Class: Extended Part; Datasheet: https://item.szlcsc.com/datasheet/RCLAMP0521P-N/297731.html; Supplier: LCSC; Polarity: Bidirectional; Reverse Stand-Off Voltage (Vrwm): 5V; Clamping Voltage: 16V; Peak Pulse Current (Ipp): 3.5A@8/20us; Peak Pulse Power Dissipation (Ppp): 60W@8/20us; Voltage - Breakdown: 6V; Reverse Leakage Current (Ir): 500nA; Number of Channels: 1; level of protection: IEC 61000-4-4；IEC 61000-4-5；IEC 61000-4-2; Type: TVS; Junction Capacitance: 0.4pF
H1 = PZ254V-11-03P: LCSC Part Name: 1x3P 间距:2.54mm 方针 直插; Supplier Part: C2937625; Manufacturer: XFCN(兴飞); Supplier Footprint: 插件,P=2.54mm; JLCPCB Part Class: Extended Part; Datasheet: https://item.szlcsc.com/datasheet/PZ254V-11-03P/3293280.html; Supplier: LCSC; Pin Structure: 1x3P; Pitch: 2.54mm; Circluar Pins/Square Pins: Pin Header; Mounting Type: Through Hole; Number of Rows: 1; Number of Pins: 3P; Current Rating: 3A; Voltage Rating (Max): 250V; Length of Mating Pin: 6mm; Insulation Height: 2.5mm; Length of End Connection Pin: 3mm; Operating Temperature: -40℃~+105℃; Color: Black
R32 R33 R35 R36 R52 R53 = 0603WAF2200T5E: LCSC Part Name: 220Ω ±1% 100mW 厚膜电阻; Supplier Part: C22962; Manufacturer: UNI-ROYAL(厚声); Supplier Footprint: 0603; JLCPCB Part Class: Basic Part; Datasheet: https://atta.szlcsc.com/upload/public/pdf/source/20200306/C422600_1E6D84923E4A46A82E41ADD87F860B5C.pdf; Supplier: LCSC; Type: Thick Film Resistors; Tolerance: ±1%; Temperature Coefficient: ±100ppm/℃; Operating Temperature Range: -55℃~+155℃
U6 U7 = PM254-1-16-Z-8.5: Holes Structure:1x16P Pitch:2.54mm Row Spacing:- Circular Hole / Square Hole:Square Holes Mounting Type:Straight Number of Rows:Plugin Number of Holes:16P Current Rating (Max):3A Voltage Rating (Max):- Holes Direction:Top Insulation Height:8.5mm Contact M; LCSC Part Name: 1x16P 间距:2.54mm 直插; Supplier Part: C2897379; Manufacturer: HCTL(华灿天禄); Supplier Footprint: 插件,P=2.54mm; JLCPCB Part Class: Extended Part; Datasheet: https://atta.szlcsc.com/upload/public/pdf/source/20230609/534BE42964C679BDE98E061007C4ABD6.pdf; Supplier: LCSC; Holes Structure: 1x16P; Pitch: 2.54mm; Circular Hole / Square Hole: Square Holes; Mounting Type: Straight; Number of Rows: Plugin; Number of Holes: 16P; Current Rating (Max): 3A; Holes Direction: Top; Insulation Height: 8.5mm; Contact Material: Copper Alloy; Operating Temperature Range: -40℃~+105℃; Soldering Temperature(Max): 260℃@5S
H2 = FTSH-107-01-F-DV-K: LCSC Part Name: 2x7P 间距:1.27mm 方针 立贴; Supplier Part: C7465995; Manufacturer: SAMTEC; Supplier Footprint: SMD,P=1.27mm; JLCPCB Part Class: Extended Part; Datasheet: https://item.szlcsc.com/datasheet/FTSH-107-01-F-DV-K/8508274.html; Supplier: LCSC; Pin Structure: 2x7P; Pitch: 1.27mm; Circluar Pins/Square Pins: Pin Header; Mounting Type: Surface Mount,Vertical; Number of Rows: 2; Number of Pins: 14P; Length of Mating Pin: 3.05mm; Contact Material: Phosphor Bronze; Contact Plating: Gold; Operating Temperature: -55℃~+125℃; Color: Black
R60 R62-R64 R67 R68 = 0402WGF330JTCE: LCSC Part Name: 33Ω ±1% 62.5mW 厚膜电阻; Supplier Part: C25105; Manufacturer: UNI-ROYAL(厚声); Supplier Footprint: 0402; JLCPCB Part Class: Basic Part; Datasheet: https://item.szlcsc.com/datasheet/0402WGF330JTCE/25848.html; Supplier: LCSC; Type: Thick Film Resistor; Tolerance: ±1%; Power(Watts): 62.5mW; Voltage-Supply(Max): 50V; Temperature Coefficient: ±100ppm/℃; Operating Temperature: -55℃~+155℃
R61 = 0402WGF330JTCE: LCSC Part Name: 33Ω ±1% 62.5mW 厚膜电阻; Supplier Part: F; Manufacturer: UNI-ROYAL(厚声); Supplier Footprint: 0402; JLCPCB Part Class: Basic Part; Datasheet: https://item.szlcsc.com/datasheet/0402WGF330JTCE/25848.html; Supplier: LCSC; Type: Thick Film Resistor; Tolerance: ±1%; Power(Watts): 62.5mW; Voltage-Supply(Max): 50V; Temperature Coefficient: ±100ppm/℃; Operating Temperature: -55℃~+155℃
C59-C62 = CC1206KRX7R9BB334: LCSC Part Name: 330nF ±10% 50V; Supplier Part: C274377; Manufacturer: YAGEO(国巨); Supplier Footprint: 1206; JLCPCB Part Class: Extended Part; Datasheet: https://atta.szlcsc.com/upload/public/pdf/source/20181008/C309510_22F155564471FAF6A489F7D68F34234E.pdf; Supplier: LCSC; Tolerance: ±10%
LED4-LED11 = SK9822-EC20: LCSC Part Name: RGB三色; Supplier Part: C2909059; Manufacturer: 欧思科光电; Supplier Footprint: SMD,2x2mm; JLCPCB Part Class: Extended Part; Datasheet: https://atta.szlcsc.com/upload/public/pdf/source/20211025/15FC8293F2644C1B2C845186EA247284.pdf; Supplier: LCSC
R21 R22 = 0402WGF1000TCE: LCSC Part Name: 100Ω ±1% 62.5mW 厚膜电阻; Supplier Part: C25076; Manufacturer: UNI-ROYAL(厚声); Supplier Footprint: 0402; JLCPCB Part Class: Basic Part; Datasheet: https://atta.szlcsc.com/upload/public/pdf/source/20200306/C422600_1E6D84923E4A46A82E41ADD87F860B5C.pdf; Supplier: LCSC; Type: Thick Film Resistors; Tolerance: ±1%; Temperature Coefficient: ±200ppm/℃; Operating Temperature Range: -55℃~+155℃
U20 = AMS1117-5.0_C6187: LCSC Part Name: 输入12V 输出5V 1A; Supplier Part: C6187; Manufacturer: AMS; Supplier Footprint: SOT-223; JLCPCB Part Class: Basic Part; Datasheet: https://atta.szlcsc.com/upload/public/pdf/source/20230918/E4B716057EE82179D88E8A0894830D59.pdf; Supplier: LCSC; Output Type: Fixed; Voltage - Supply: 12V; Output Voltage: 5V; Output Current: 1A; Voltage Dropout: 1.3V@(1A); Features: Overcurrent Protection(OCP); Output Configuration: Positive electrode; Number of Outputs: 1
C33 = CL21A106KAYNNNE_C15850: Capacitance: Tolerance:±10% Tolerance:±10% Voltage Rated: Temperature Coefficient:; LCSC Part Name: 10uF ±10% 25V; Supplier Part: C15850; Manufacturer: SAMSUNG(三星); Manufacturer Part: CL21A106KAYNNNE; Supplier Footprint: 0805; JLCPCB Part Class: Basic Part; Datasheet: https://atta.szlcsc.com/upload/public/pdf/source/20160218/1457707763339.pdf; Supplier: LCSC; Tolerance: ±10%
C2 C5 C34 = CL05A225KO5NQNC: Capacitance: Tolerance:±10% Tolerance:±10% Voltage Rated: Temperature Coefficient:; LCSC Part Name: 2.2uF ±10% 16V; Supplier Part: C170151; Manufacturer: SAMSUNG(三星); Supplier Footprint: 0402; JLCPCB Part Class: Extended Part; Datasheet: https://atta.szlcsc.com/upload/public/pdf/source/20160218/1457707763339.pdf; Supplier: LCSC; Tolerance: ±10%
C35 = GRM033R71E103KE14D: Capacitance: Tolerance:±10% Tolerance:±10% Voltage Rated: Temperature Coefficient:; LCSC Part Name: 10nF ±10% 25V; Supplier Part: C85930; Manufacturer: muRata(村田); Supplier Footprint: 0201; JLCPCB Part Class: Extended Part; Datasheet: https://atta.szlcsc.com/upload/public/pdf/source/20200305/C490387_23319AE8C154DEB24C505E6C82A8106A.pdf; Supplier: LCSC; Tolerance: ±10%
C16 C63 = CL05A105KA5NQNC: Capacitance: Tolerance:±10% Tolerance:±10% Voltage Rated: Temperature Coefficient:; LCSC Part Name: 1uF ±10% 25V; Supplier Part: C52923; Manufacturer: SAMSUNG(三星); Supplier Footprint: 0402; JLCPCB Part Class: Basic Part; Datasheet: https://atta.szlcsc.com/upload/public/pdf/source/20160218/1457707763339.pdf; Supplier: LCSC; Tolerance: ±10%
C65 C66 = CL10B223KB8NNNC: LCSC Part Name: 22nF ±10% 50V; Supplier Part: C21122; Manufacturer: SAMSUNG(三星); Supplier Footprint: 0603; JLCPCB Part Class: Basic Part; Datasheet: https://item.szlcsc.com/datasheet/CL10B223KB8NNNC/21834.html; Supplier: LCSC; Tolerance: ±10%; Voltage Rating: 50V; Temperature Coefficient: X7R
LED3 = TZ-P2-0402RTIA1-0.45T: Illumination Color:Red Power(Watts):60mW Forward Current:- Wavelength - Dominant:620nm~625nm Wavelength - Dominant:620nm~625nm Peak Wavelength:633nm Diode Configuration:- Lens Color:Water Clear Color Temperature:- Color Temperature:- Viewing Angle:120° Mo; LCSC Part Name: 红灯; Supplier Part: C779449; Manufacturer: TUOZHAN(拓展光电); Supplier Footprint: 0402; JLCPCB Part Class: Extended Part; Datasheet: https://atta.szlcsc.com/upload/public/pdf/source/20200925/C779449_A9A3CFAD739F0709457D250F53980B4F.pdf; Supplier: LCSC; Illumination Color: Red; Power(Watts): 60mW; Wavelength - Dominant: 620nm~625nm; Peak Wavelength: 633nm; Lens Color: Water Clear; Viewing Angle: 120°; Operating Temperature: -40℃~+80℃
R7 = RC0402FR-073K3L: Type:Thick Film Resistors Resistance: Tolerance:±1% Tolerance:±1% Power(Watts): Overload Voltage (Max): Temperature Coefficient:±100ppm/℃ Temperature Coefficient:±100ppm/℃ Operating Temperature Range:-55℃~+155℃ Operating Temperature Range:-55℃~+155℃; LCSC Part Name: 厚膜电阻 3.3kΩ ±1% 62.5mW; Supplier Part: C137992; Manufacturer: YAGEO(国巨); Supplier Footprint: 0402; JLCPCB Part Class: Extended Part; Datasheet: https://atta.szlcsc.com/upload/public/pdf/source/20181009/C309620_DA5935B6E1D48212CB7A533FE518B3C2.pdf; Supplier: LCSC; Type: Thick Film Resistors; Tolerance: ±1%; Temperature Coefficient: ±100ppm/℃; Operating Temperature Range: -55℃~+155℃
R10-R14 = RC0402FR-0747KL: Type:Thick Film Resistors Resistance: Tolerance:±1% Tolerance:±1% Power(Watts): Overload Voltage (Max): Temperature Coefficient:±100ppm/℃ Temperature Coefficient:±100ppm/℃ Operating Temperature Range:-55℃~+155℃ Operating Temperature Range:-55℃~+155℃; LCSC Part Name: 厚膜电阻 47kΩ ±1% 62.5mW; Supplier Part: C93943; Manufacturer: YAGEO(国巨); Supplier Footprint: 0402; JLCPCB Part Class: Extended Part; Datasheet: https://atta.szlcsc.com/upload/public/pdf/source/20180821/C275644_0D56F95EFF785E7D9A1FEF436B37DA78.pdf; Supplier: LCSC; Type: Thick Film Resistors; Tolerance: ±1%; Temperature Coefficient: ±100ppm/℃; Operating Temperature Range: -55℃~+155℃
R73 R74 = RC0603FR-074R7L: LCSC Part Name: 厚膜电阻 4.7Ω ±1% 100mW; Supplier Part: C137705; Manufacturer: YAGEO(国巨); Supplier Footprint: 0603; JLCPCB Part Class: Extended Part; Datasheet: https://atta.szlcsc.com/upload/public/pdf/source/20180821/C275644_0D56F95EFF785E7D9A1FEF436B37DA78.pdf; Supplier: LCSC; Type: Thick Film Resistors; Tolerance: ±1%; Temperature Coefficient: ±200ppm/℃; Operating Temperature Range: -55℃~+155℃
U2 = DRV8833PWPR: Technology:Yes Operating Temperature:-40℃~+85℃ Operating Temperature:-40℃~+85℃; LCSC Part Name: 1.5A 有刷直流电机驱动芯片 10.8V; Supplier Part: C50506; Manufacturer: TI(德州仪器); Supplier Footprint: TSSOP-16-EP; JLCPCB Part Class: Extended Part; Datasheet: https://www.ti.com/cn/lit/gpn/drv8833; Supplier: LCSC; Technology: Yes; Operating Temperature: -40℃~+85℃
U16 U17 = HoLRT1206-1W-130mR-1%: Type:Current Sensing Resistors Resistance:130mΩ Tolerance:±1% Tolerance:±1% Power(Watts): Mounting Sytle:Chip; LCSC Part Name: 130mΩ ±1% 1W; Supplier Part: C5127779; Manufacturer: Milliohm(毫欧); Supplier Footprint: 1206; JLCPCB Part Class: Extended Part; Datasheet: https://atta.szlcsc.com/upload/public/pdf/source/20220914/EABE52D611B55B2DB900669D9E979D8B.pdf; Supplier: LCSC; Type: Current Sensing Resistors; Tolerance: ±1%; Mounting Sytle: Chip
U24 U25 = ZX-SH1.0-6PLT: LCSC Part Name: 1x6P 间距:1mm 立贴 系列:SH; Supplier Part: C7430455; Manufacturer: Megastar(兆星); Supplier Footprint: SMD,P=1mm; JLCPCB Part Class: Extended Part; Datasheet: https://item.szlcsc.com/datasheet/ZX-SH1.0-6PLT/8430324.html; Supplier: LCSC; Pins Structure: 1x6P; Pitch: 1mm; Mounting Type: Surface Mount,Vertical; Reference Series: SH; Number of Pins: 6P; Number of Rows: 1; Number of PINs Per Row: 6; Current Rating: 1A; Contact Material: Brass; Contact Plating: Tin; Supplementary Features: Auxiliary Solder Pin; Color: Beige; Z-Height of the Board: 4.4mm; X-Length of Bottom Edge on Board (Spacing Line): 8.35mm; Y-Width of Bottom Edge on Board: 3.74mm
R25-R30 = 0402WGF4700TCE: LCSC Part Name: 470Ω ±1% 62.5mW 厚膜电阻; Supplier Part: C25117; Manufacturer: UNI-ROYAL(厚声); Supplier Footprint: 0402; JLCPCB Part Class: Basic Part; Datasheet: https://item.szlcsc.com/datasheet/0402WGF4700TCE/25860.html; Supplier: LCSC; Type: Thick Film Resistor; Tolerance: ±1%; Power(Watts): 62.5mW; Voltage-Supply(Max): 50V; Temperature Coefficient: ±100ppm/℃; Operating Temperature: -55℃~+155℃
SERVO2 = HX PZ2.54-3x6P ZZ: LCSC Part Name: 3x6P 间距:2.54mm 方针 直插; Supplier Part: C32713293; Manufacturer: hanxia(韩下); Supplier Footprint: 插件,P=2.54mm; JLCPCB Part Class: Extended Part; Datasheet: https://atta.szlcsc.com/upload/public/pdf/source/20240723/B9E8CCE7746998ECA93891F2E834C7B0.pdf; Supplier: LCSC; Pin Structure: 3x6P; Pitch: 2.54mm; Row Spacing: 2.54mm; Circluar Pins/Square Pins: Policy; Mounting Type: Straight; Number of Rows: Triple row; Number of Pins: 18P; Current Rating: 3A; Length of Mating Pin: 6mm; Insulation Height: 2.5mm; Length of End Connection Pin: 3mm; Contact Material: Brass; Contact Plating: Gold; Operating Temperature: -40℃~+105℃; Color: Black
BOOT0 NRST1 = GT-TC063B-H035-L10: LCSC Part Name: 6.2*6.2*3.5mm 立贴 轻触开关; Supplier Part: C967702; Manufacturer: G-Switch(品赞); Supplier Footprint: SMD-4P,6.2x6.2mm; JLCPCB Part Class: Extended Part; Datasheet: https://item.szlcsc.com/datasheet/GT-TC063B-H035-L10/1054451.html; Supplier: LCSC; Circuit: SPST; Actuator Style: Round Button; Operating Force: 2.5N; Mounting Type: Surface Mount,Vertical; Length: 6.2mm; Width: 6.2mm; Switch Height: 3.5mm; with Bracket: Without Bracket; Contact Current: 50mA; Voltage Rating: 12V; Actuator/Cap Color: Gray; With Lamp: No; Termination Style: SMD(SMT) Tab; Life: 1,000,000 Cycles; Operating Temperature: -30℃~+85℃
C15 C36 C38 = CL05A475MP5NRNC: Capacitance: Tolerance:±20% Tolerance:±20% Voltage Rated: Temperature Coefficient:; LCSC Part Name: 4.7uF ±20% 10V; Supplier Part: C23733; Manufacturer: SAMSUNG(三星); Supplier Footprint: 0402; JLCPCB Part Class: Basic Part; Datasheet: https://atta.szlcsc.com/upload/public/pdf/source/20160218/1457707763339.pdf; Supplier: LCSC; Tolerance: ±20%
SCREW1-SCREW4 = Screw-Hole-M2: Supplier Footprint: 插件
U9 = STM32H563RIT6: Supplier Part: C20619634; Manufacturer: ST(意法半导体); Supplier Footprint: LQFP-64(10x10); JLCPCB Part Class: Extended Part; Datasheet: https://atta.szlcsc.com/upload/public/pdf/source/20250210/80123AA40608A8B967F024ADDC330E8C.pdf; Supplier: LCSC
R8 R9 = RMC04022.2K5%N: Resistance:2.2kΩ Tolerance:±5% Tolerance:±5% Power(Watts):62.5mW; LCSC Part Name: 2.2kΩ ±5% 62.5mW; Supplier Part: C269678; Manufacturer: Tyohm(幸亚电阻); Supplier Footprint: 0402; JLCPCB Part Class: Extended Part; Datasheet: https://atta.szlcsc.com/upload/public/pdf/source/20190115/C325956_D27151D492FFB3C9AB4A6F14FE01F30A.pdf; Supplier: LCSC; Tolerance: ±5%; Power(Watts): 62.5mW
R44 R45 = 0402WGF220JTCE: LCSC Part Name: 22Ω ±1% 62.5mW 厚膜电阻; Supplier Part: C25092; Manufacturer: UNI-ROYAL(厚声); Supplier Footprint: 0402; JLCPCB Part Class: Basic Part; Datasheet: https://atta.szlcsc.com/upload/public/pdf/source/20200306/C422600_1E6D84923E4A46A82E41ADD87F860B5C.pdf; Supplier: LCSC; Type: Thick Film Resistors; Tolerance: ±1%; Temperature Coefficient: ±100ppm/℃; Operating Temperature Range: -55℃~+155℃
U18 = VL53L7CXV0GC/1: Supplier Part: C5270520; Manufacturer: ST(意法半导体); Supplier Footprint: LGA-16(3x6.4); JLCPCB Part Class: Extended Part; Datasheet: https://atta.szlcsc.com/upload/public/pdf/source/20230906/A32984EEE2E80DE638D682AB39A2BFCF.pdf; Supplier: LCSC

## Nets
+3.3V: adc6.4 ADC24.1 BOOT0.1 BOOT0.2 C15.2 C16.2 C17.2 C19.2 C20.2 C21.2 C22.2 C24.2 C27.2 C36.2 C37.2 C38.2 C67.2 D5.2 D6.2 H2.3 R1.2 R3.2 R7.2 R8.2 R9.2 R10.2 R11.2 R13.2 R14.2 tof5.4 U6.1 U9.1(VBAT) U9.13(VDDA) U9.19(VDD) U9.32(VDD) U9.48(VDD) U9.64(VDD) U10.4(VOUT) U10.5(VOUT) U18.A4(IOVDD) U18.B1(AVDD) U18.B7(AVDD) U24.5 U25.5
+5.0V: C42.2 C59.2 C60.2 C61.2 C62.2 LED4.5(VDD) LED5.5(VDD) LED6.5(VDD) LED7.5(VDD) LED8.5(VDD) LED9.5(VDD) LED10.5(VDD) LED11.5(VDD) U20.2(VOUT) U20.4(VOUT)
+6.0V: C30.2 C64.2 R4.2 R6.2 SERVO2.7 SERVO2.8 SERVO2.9 SERVO2.10 SERVO2.11 SERVO2.12 U11.4(VOUT) U11.5(VOUT) U20.3(VIN) U22.1
GND: adc6.1 adc6.5 adc6.6 ADC24.6 ADC24.7 ADC24.8 BAT3.2 C2.2 C5.2 C15.1 C16.1 C17.1 C19.1 C20.1 C21.1 C22.1 C24.1 C25.1 C26.1 C27.1 C28.1 C29.1 C30.1 C32.1 C33.1 C34.1 C36.1 C37.1 C38.1 C42.1 C51.1 C52.1 C53.1 C54.1 C55.1 C56.1 C57.1 C58.1 C59.1 C60.1 C61.1 C62.1 C63.1 C64.1 C67.1 D1.1 D2.1 D3.1 D4.1 D5.1 D6.1 D7.1 D8.1 D9.1 D10.1 D11.1 D12.1 D13.1 D14.1 D15.1 D16.1 D17.1 H1.3 H2.5 H2.7 H2.11 LED4.2(GND) LED5.2(GND) LED6.2(GND) LED7.2(GND) LED8.2(GND) LED9.2(GND) LED10.2(GND) LED11.2(GND) NRST1.3 NRST1.4 R2.1 R5.1 R12.1 R23.1 R31.2 SERVO2.13 SERVO2.14 SERVO2.15 SERVO2.16 SERVO2.17 SERVO2.18 tof5.1 tof5.5 tof5.6 U2.13(GND) U2.17(GND) U6.15 U7.1 U7.12 U7.15 U9.12(VSSA) U9.18(VSS) U9.31(VSS) U9.47(VSS) U9.63(VSS) U10.3(GND) U10.9(EP) U11.3(GND) U11.9(EP) U16.1 U17.1 U18.A2(RSVD4) U18.A6(RSVD1) U18.A7(RSVD2) U18.B4(THERMALPAD) U18.C1(GND) U18.C6(RSVD3) U18.C7(GND) U20.1(GND) U22.2 U23.2 U24.1 U24.7 U24.8 U25.1 U25.7 U25.8
VBAT_VSENS: C51.2 R23.2 R24.1 U9.21(PA5)
VIN: C26.2 C29.2 C32.2 C33.2 C35.1 F1.1 R24.2 U2.12(VM) U10.1(EN) U10.2(VIN) U11.1(EN) U11.2(VIN) U23.1
ADC4: C56.2 R49.1 U9.24(PC4)
ADC8: C57.2 R50.1 U9.25(PC5)
ADC9: C58.2 R51.1 U9.26(PB0)
ADC10: C53.2 R46.1 U9.8(PC0)
ADC11: C54.2 R47.1 U9.9(PC1)
ADC13: C55.2 R48.1 U9.11(PC3)
BOOT0: BOOT0.3 BOOT0.4 R31.1 U9.60(BOOT0)
ENCODER1_1: D3.2 R33.1 U24.4
ENCODER1_2: D4.2 R32.1 U24.3
ENCODER2_1: D1.2 R36.2 U25.4
ENCODER2_2: D2.2 R35.2 U25.3
JTCK_SWCLK: R67.1 U9.49(PA14)
JTDI: R63.1 U9.50(PA15)
JTDO: R64.1 U9.55(PB3)
JTMS_SWDIO: R68.1 U9.46(PA13)
MODEM_RX: R53.2 U9.52(PC11)
MODEM_TX: R52.2 U9.51(PC10)
NJTRST: U9.56(PB4)
NRST: C52.2 NRST1.1 NRST1.2 R62.1 U9.7(NRST)
PWM1: U2.16(AIN1) U9.14(PA0)
PWM2: U2.9(BIN1) U9.15(PA1)
RGB_MOSI: R21.1 U9.36(PB15)
RGB_SCK: R22.1 U9.34(PB13)
SENS1: U2.15(AIN2) U9.29(PB10)
SENS2: U2.10(BIN2) U9.28(PB2)
SERVO1: R25.1 U9.16(PA2)
SERVO2: R26.1 U9.17(PA3)
SERVO3: R27.1 U9.35(PB14)
SERVO4: R28.1 U9.42(PA9)
SERVO5: R29.1 U9.44(PA11)
SERVO6: R30.1 U9.10(PC2)
TOF1_SCL: R9.1 U9.61(PB8) U18.C4(SCL)
TOF1_SDA: R8.1 U9.59(PB7) U18.C3(SDA)
TOF2_SCL: R44.1 U9.41(PA8)
TOF2_SDA: R45.1 U9.40(PC9)
USART1_RX: R60.2 U9.43(PA10)
USART1_TX: R61.1 U9.58(PB6)
$1N3928: C35.2 U2.11(VCP)
$1N4156: C34.2 U2.14(VINT)
$1N4345: C65.2 U2.7(BOUT1) U25.2
$1N4374: R73.1 U2.2(AOUT1) U24.6
$1N5186: LED3.2(A) R7.1
$1N5206: LED3.1(K) U2.8(nFault)
$1N5359: U2.3(AISEN) U16.2
$1N5410: U2.6(BISEN) U17.2
$1N10486: C66.2 U2.4(AOUT2) U24.2
$1N11048: C63.2 R11.1 U2.1(nSleep)
$1N12603: R74.1 U2.5(BOUT2) U25.6
$1N13824: C66.1 R73.2
$1N13826: C65.1 R74.2
$2N361: C2.1 C5.1 U9.30(VCAP) U9.62(VCAP)
$2N8197: R32.2 U9.23(PA7)
$2N8237: R33.2 U9.22(PA6)
$2N8396: R35.1 U9.38(PC7)
$2N8439: R36.1 U9.37(PC6)
$3N248: C25.2 U10.8(SS/TR)
$3N507: LED1.1(K) U10.7(PG)
$3N645: LED1.2(A) R1.1
$3N740: R2.2 R3.1 U10.6(FB)
$3N1481: C28.2 U11.8(SS/TR)
$3N1484: LED2.1(K) U11.7(PG)
$3N1485: LED2.2(A) R4.1
$3N1486: R5.2 R6.1 U11.6(FB)
$3N5305: BAT3.1 D7.2 F1.2
$4N413: R13.1 U18.A5(LPn)
$4N484: R12.2 U18.A1(I2C_RST)
$4N541: R10.1 U18.A3(INT)
$4N833: R14.1 U18.C2(RSVD6)
$4N4166: R44.2 tof5.3
$4N4209: R45.2 tof5.2
$5N411: LED4.3(SDI) LED5.1(SDO)
$5N415: LED4.4(CKL) LED5.6(CKO)
$5N420: LED5.3(SDI) LED6.1(SDO)
$5N425: LED5.4(CKL) LED6.6(CKO)
$5N430: LED6.3(SDI) LED7.1(SDO)
$5N439: LED6.4(CKL) LED7.6(CKO)
$5N768: LED7.4(CKL) LED8.6(CKO)
$5N772: LED8.4(CKL) LED9.6(CKO)
$5N777: LED9.4(CKL) LED10.6(CKO)
$5N782: LED7.3(SDI) LED8.1(SDO)
$5N787: LED8.3(SDI) LED9.1(SDO)
$5N792: LED9.3(SDI) LED10.1(SDO)
$5N797: LED10.3(SDI) LED11.1(SDO)
$5N801: LED10.4(CKL) LED11.6(CKO)
$5N1333: LED11.3(SDI) R21.2
$5N1382: LED11.4(CKL) R22.2
$6N595: D13.2 R25.2 SERVO2.1
$6N638: D12.2 R26.2 SERVO2.2
$6N681: D11.2 R27.2 SERVO2.3
$6N724: D10.2 R28.2 SERVO2.4
$6N810: D8.2 R30.2 SERVO2.6
$6N855: D9.2 R29.2 SERVO2.5
$7N449: D14.2 H1.1 R53.1 U7.5
$7N1405: D15.2 H1.2 R52.1 U7.4
$8N1824: H2.14 R61.2
$8N1829: H2.12 R62.2
$8N1835: H2.10 R63.2
$8N1841: H2.8 R64.2
$8N1846: D17.2 H2.6 R67.2
$8N1852: D16.2 H2.4 R68.2
$8N2131: H2.13 R60.1
$9N336: ADC24.2 R46.2
$9N337: ADC24.5 R49.2
$9N338: adc6.2 R50.2
$9N339: adc6.3 R51.2
$9N340: ADC24.3 R47.2
$9N341: ADC24.4 R48.2

Not connected (* = marked no-connect by the designer): H2 1* 2* 9*; LED4 1(SDO)* 6(CKO)*; SCREW1 1*; SCREW2 1*; SCREW3 1*; SCREW4 1*; U6 2* 3* 4* 5* 6* 7* 8* 9* 10* 11* 12* 13* 14* 16*; U7 2* 3* 6* 7* 8* 9* 10* 11* 13* 14* 16*; U9 2(PC13)* 3(PC14-OSC32_IN)* 4(PC15-OSC32_OUT)* 5(PH0-OSC_IN)* 6(PH1-OSC_OUT)* 20(PA4)* 27(PB1)* 33(PB12)* 39(PC8)* 45(PA12)* 53(PC12)* 54(PD2)* 57(PB5)*; U18 C5(RSVD5)*

## Notes on the sheets
sheet 1
- moteur 1 et 2
  chatgpt conseille une grosse capa réservoire, pourtant pololu n'en met pas.
- 50ms
- fault
- limitation de courant si
  Imax = 0.2 / Rshunt
  Rshunt = 0.2 / Imax
  2 x 1.5A  max
- RC snubber anti ringing
- verifier position des pins
  séparer + et - moteur pour la dissipation thermique
  (à chaque extrémité)
sheet 2
- button de reset
  JTAG + UART1 avec
sheet 3
- alim 2S 7.2V
  efuse 12V 3.5A (3A moteur, 3.3V <1 A numerique, 6V/3A led + servo) 6A
- 3.3v
- 3A
- 6v
- 3A
sheet 4
- LPN ? INT ?
  TOF2 sur connecteur petit jst pix4 ?
  4 points 3.3 GND TX RX
- TOF2
  22 ohm en protection
  rajouter des pin UART rx tx ?
sheet 5
- L'alimenation est imposante
  le condo est gros mais le regulateur aussi
- une pour 2 leds
sheet 6
- servo
  plusieurs rangé de 3 en 2.54
  6 servos possibles
  des capa aiderait à aller plus vite, mais il faudrait des grosses valeurs
  (330-670uF)
sheet 7
- esp32-c5 devkit
  UART "MODEM" sur UART1
  UART0 + usb pour le debug
- Antenne
- GPIO23
  GPIO24
- USB
sheet 8
- jtag
  SWDIO de base
  + UART0
  + jtag
  MIPI-14 connecteur 1.27 2*7 avec UART
  MIPI-10 est le connecteur standard un femelle MIPI-10 peut se connecter sur le 14
  Les lignes sont protégé par des 220R
  il faudrait trouver le petit connecteur de base ou l'inverse -> on colle à GND
  T_VCC mesure de l'alim par la sonde
  GNDDETECT 11 sert à detecter la presence de la sonde
- T_VCC
- Le petit double détrompeur est en haut
  Les diodes ESD prendraient trop de place ?
- Les résistances sont à mettre proche du MCU (terminaison de ligne)
  C'est des 22-100 ohm max pour des cables un peu long.
sheet 9
- ADC 100Hz
